# Altium project AccessControl.PrjPcb (part 1 of 2)
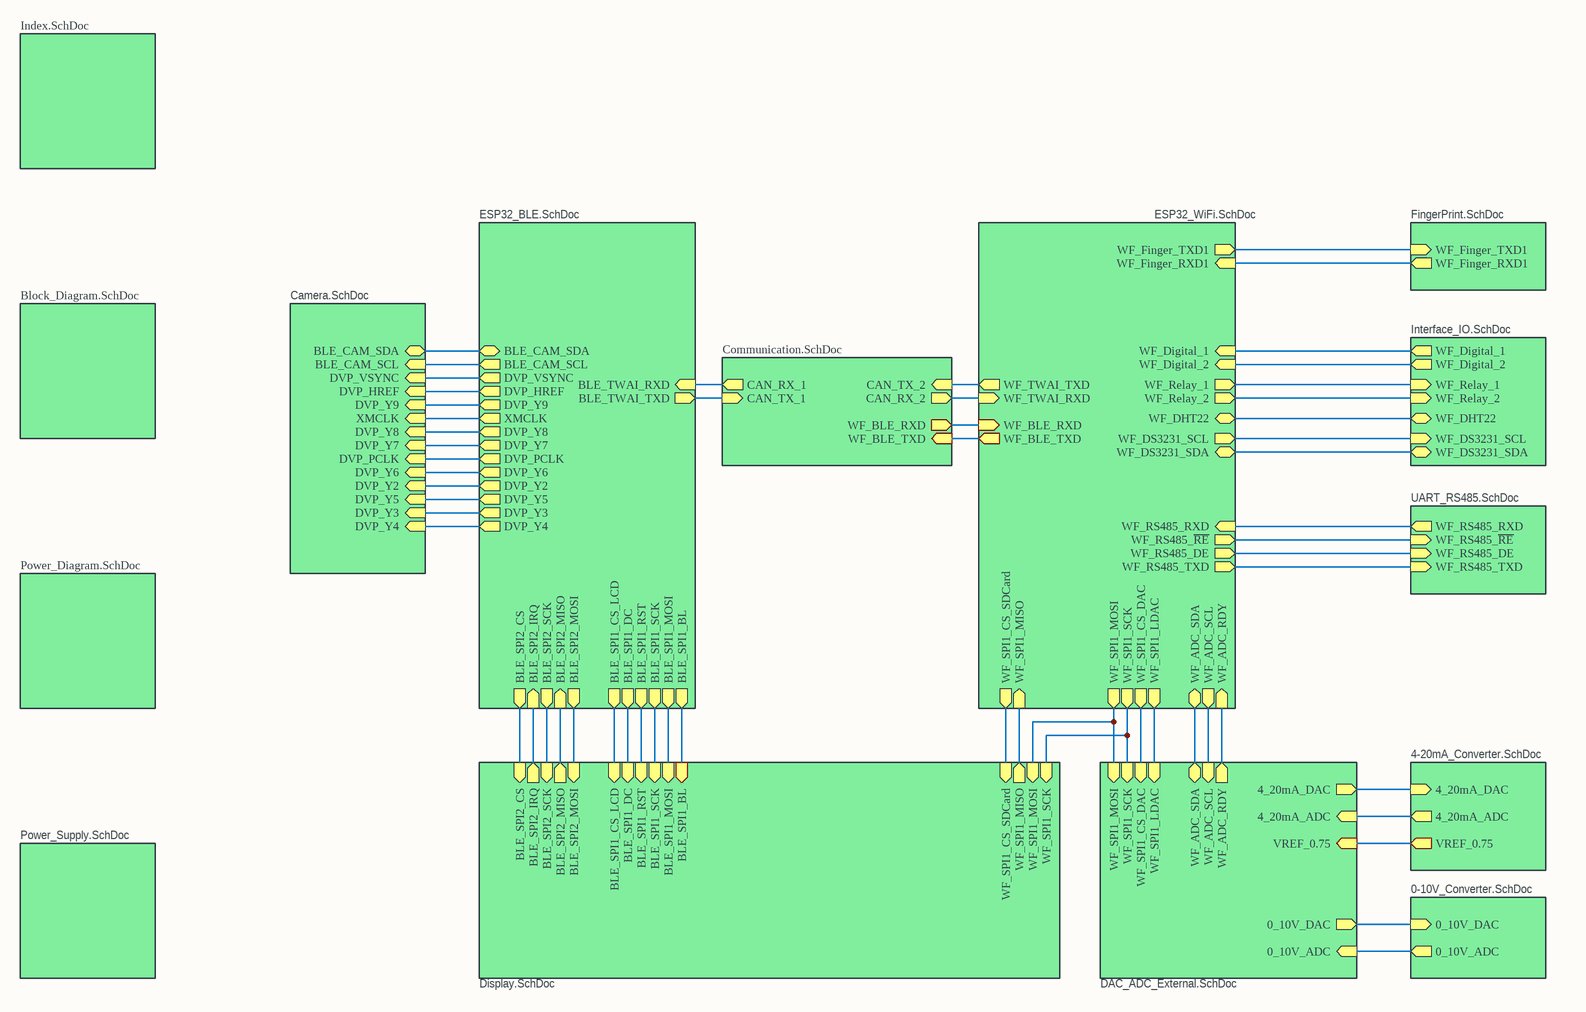
[diagram p0: Overview_Schematic.SchDoc]
16 sheets, 311 parts. Net scope: hierarchical (ports join the sheet entries above them; power ports are global).
Board files: AccessControl_V1.0.0.PcbDoc, AccessControl_V1.0.1.PcbDoc
Sheets:
  Overview_Schematic.SchDoc
    Designator = ESP32_BLE.SchDoc
    Designator = ESP32_WiFi.SchDoc
    Designator = Power_Supply.SchDoc
    Designator = DAC_ADC_External.SchDoc
    Designator = 4-20mA_Converter.SchDoc
    Designator = 0-10V_Converter.SchDoc
    Designator = UART_RS485.SchDoc
    Designator = Camera.SchDoc
    Designator = Display.SchDoc
    Designator = Interface_IO.SchDoc
    Designator = FingerPrint.SchDoc
    Designator = Block_Diagram.SchDoc
    Designator = Index.SchDoc
    Designator = Power_Diagram.SchDoc
    Designator = Communication.SchDoc

## Sheet Overview_Schematic.SchDoc: Access Control
size A3; Project: Bluetooth Gateway; ENG_APP_DATE: --/--/--; DSN_APP_DATE: --/--/--; CHK_APP_DATE: --/--/--; DrawnBy: Q.Thang & T.Khoa; Revision: V1.0.1; SheetNumber: 1; SheetTotal: 16

### Sub-sheets
Designator = ESP32_BLE.SchDoc: BLE_CAM_SDA (bidir), BLE_CAM_SCL (out), DVP_VSYNC (out), DVP_HREF (out), DVP_Y9 (out), XMCLK (out), DVP_Y8 (out), DVP_Y7 (out), DVP_PCLK (out), DVP_Y6 (out), DVP_Y2 (out), DVP_Y5 (out), DVP_Y3 (out), DVP_Y4 (out), BLE_SPI1_DC (out), BLE_SPI1_SCK (out), BLE_SPI1_MOSI (out), BLE_SPI1_RST (out), BLE_SPI1_CS_LCD (out), BLE_SPI2_MOSI (out), BLE_SPI2_MISO (in), BLE_SPI2_SCK (out), BLE_SPI2_IRQ (in), BLE_SPI2_CS (out), BLE_TWAI_RXD (in), BLE_TWAI_TXD (out), BLE_SPI1_BL (out)
Designator = ESP32_WiFi.SchDoc: WF_SPI1_MOSI (out), WF_SPI1_SCK (out), WF_SPI1_CS_DAC (out), WF_SPI1_LDAC (out), WF_RS485_RXD (in), WF_RS485_~{RE} (out), WF_RS485_DE (out), WF_RS485_TXD (out), WF_Digital_1 (in), WF_Digital_2 (in), WF_Relay_1 (out), WF_Relay_2 (out), WF_DHT22 (bidir), WF_DS3231_SCL (out), WF_DS3231_SDA (bidir), WF_Finger_TXD1 (out), WF_Finger_RXD1 (in), WF_TWAI_TXD (out), WF_TWAI_RXD (in), WF_SPI1_MISO (in), WF_SPI1_CS_SDCard (out), WF_ADC_SDA (bidir), WF_ADC_SCL (out), WF_ADC_RDY (in), WF_BLE_RXD (in), WF_BLE_TXD (out)
Designator = Power_Supply.SchDoc: no entries
Designator = DAC_ADC_External.SchDoc: WF_SPI1_MOSI (in), WF_SPI1_SCK (in), WF_SPI1_CS_DAC (in), WF_SPI1_LDAC (in), 4_20mA_DAC (out), 4_20mA_ADC (in), 0_10V_ADC (in), 0_10V_DAC (out), WF_ADC_SDA (bidir), WF_ADC_SCL (in), WF_ADC_RDY (out), VREF_0.75 (in)
Designator = 4-20mA_Converter.SchDoc: 4_20mA_DAC (in), 4_20mA_ADC (out), VREF_0.75 (out)
Designator = 0-10V_Converter.SchDoc: 0_10V_DAC (in), 0_10V_ADC (out)
Designator = UART_RS485.SchDoc: WF_RS485_RXD (out), WF_RS485_~{RE} (in), WF_RS485_DE (in), WF_RS485_TXD (in)
Designator = Camera.SchDoc: BLE_CAM_SDA (bidir), BLE_CAM_SCL (in), DVP_VSYNC (in), DVP_HREF (in), DVP_Y9 (in), XMCLK (in), DVP_Y8 (in), DVP_Y7 (in), DVP_PCLK (in), DVP_Y6 (in), DVP_Y2 (in), DVP_Y5 (in), DVP_Y3 (in), DVP_Y4 (in)
Designator = Display.SchDoc: BLE_SPI1_MOSI (in), BLE_SPI1_SCK (in), BLE_SPI1_CS_LCD (in), BLE_SPI1_DC (in), BLE_SPI1_RST (in), BLE_SPI2_MOSI (in), BLE_SPI2_MISO (out), BLE_SPI2_SCK (in), BLE_SPI2_IRQ (out), BLE_SPI2_CS (in), WF_SPI1_MOSI (in), WF_SPI1_SCK (in), WF_SPI1_CS_SDCard (in), WF_SPI1_MISO (out), BLE_SPI1_BL (in)
Designator = Interface_IO.SchDoc: WF_Digital_1 (out), WF_Digital_2 (out), WF_Relay_1 (in), WF_Relay_2 (in), WF_DHT22 (bidir), WF_DS3231_SCL (in), WF_DS3231_SDA (bidir)
Designator = FingerPrint.SchDoc: WF_Finger_RXD1 (out), WF_Finger_TXD1 (in)
Designator = Block_Diagram.SchDoc: no entries
Designator = Index.SchDoc: no entries
Designator = Power_Diagram.SchDoc: no entries
Designator = Communication.SchDoc: CAN_RX_1 (out), CAN_TX_1 (in), CAN_RX_2 (out), CAN_TX_2 (in), WF_BLE_RXD (out), WF_BLE_TXD (in)

### Nets
Vref_0.75V: sheet Designator/VREF_0.75, sheet Designator/VREF_0.75
NetD11_A: sheet Designator/4_20mA_ADC, sheet Designator/4_20mA_ADC
NetD13_A: sheet Designator/0_10V_ADC, sheet Designator/0_10V_ADC
NetJ3_3: sheet Designator/BLE_CAM_SDA, sheet Designator/BLE_CAM_SDA
NetJ3_5: sheet Designator/BLE_CAM_SCL, sheet Designator/BLE_CAM_SCL
NetJ3_7: sheet Designator/DVP_VSYNC, sheet Designator/DVP_VSYNC
NetJ3_9: sheet Designator/DVP_HREF, sheet Designator/DVP_HREF
NetJ3_12: sheet Designator/DVP_Y9, sheet Designator/DVP_Y9
NetJ3_13: sheet Designator/XMCLK, sheet Designator/XMCLK
NetJ3_14: sheet Designator/DVP_Y8, sheet Designator/DVP_Y8
NetJ3_16: sheet Designator/DVP_Y7, sheet Designator/DVP_Y7
NetJ3_17: sheet Designator/DVP_PCLK, sheet Designator/DVP_PCLK
NetJ3_18: sheet Designator/DVP_Y6, sheet Designator/DVP_Y6
NetJ3_19: sheet Designator/DVP_Y2, sheet Designator/DVP_Y2
NetJ3_20: sheet Designator/DVP_Y5, sheet Designator/DVP_Y5
NetJ3_21: sheet Designator/DVP_Y3, sheet Designator/DVP_Y3
NetJ3_22: sheet Designator/DVP_Y4, sheet Designator/DVP_Y4
NetJ5_2: sheet Designator/WF_DHT22, sheet Designator/WF_DHT22
NetJ7_2: sheet Designator/WF_TWAI_RXD, sheet Designator/WF_BLE_RXD, sheet Designator/CAN_RX_2, sheet Designator/WF_BLE_RXD
NetJ8_2: sheet Designator/WF_TWAI_TXD, sheet Designator/WF_BLE_TXD, sheet Designator/CAN_TX_2, sheet Designator/WF_BLE_TXD
NetLCD1_3: sheet Designator/BLE_SPI1_CS_LCD, sheet Designator/BLE_SPI1_CS_LCD
NetLCD1_4: sheet Designator/BLE_SPI1_RST, sheet Designator/BLE_SPI1_RST
NetLCD1_5: sheet Designator/BLE_SPI1_DC, sheet Designator/BLE_SPI1_DC
NetLCD1_6: sheet Designator/BLE_SPI1_MOSI, sheet Designator/BLE_SPI1_MOSI
NetLCD1_11: sheet Designator/BLE_SPI2_CS, sheet Designator/BLE_SPI2_CS
NetLCD1_12: sheet Designator/BLE_SPI2_MOSI, sheet Designator/BLE_SPI2_MOSI
NetLCD1_13: sheet Designator/BLE_SPI2_MISO, sheet Designator/BLE_SPI2_MISO
NetLCD1_14: sheet Designator/BLE_SPI2_IRQ, sheet Designator/BLE_SPI2_IRQ
NetLCD1_15: sheet Designator/WF_SPI1_CS_SDCard, sheet Designator/WF_SPI1_CS_SDCard
NetLCD1_16: sheet Designator/WF_SPI1_MOSI, sheet Designator/WF_SPI1_MOSI, sheet Designator/WF_SPI1_MOSI
NetLCD1_17: sheet Designator/WF_SPI1_MISO, sheet Designator/WF_SPI1_MISO
NetQ1_1: sheet Designator/BLE_SPI1_BL, sheet Designator/BLE_SPI1_BL
NetR19_2: sheet Designator/BLE_SPI2_SCK, sheet Designator/BLE_SPI2_SCK
NetR35_1: sheet Designator/BLE_SPI1_SCK, sheet Designator/BLE_SPI1_SCK
NetR38_1: sheet Designator/WF_SPI1_SCK, sheet Designator/WF_SPI1_SCK, sheet Designator/WF_SPI1_SCK
NetR43_1: sheet Designator/WF_Finger_RXD1, sheet Designator/WF_Finger_RXD1
NetR44_1: sheet Designator/WF_Finger_TXD1, sheet Designator/WF_Finger_TXD1
NetR46_1: sheet Designator/WF_RS485_RXD, sheet Designator/WF_RS485_RXD
NetR47_1: sheet Designator/WF_RS485_~{RE}, sheet Designator/WF_RS485_~{RE}
NetR49_1: sheet Designator/WF_RS485_DE, sheet Designator/WF_RS485_DE
NetR50_1: sheet Designator/WF_RS485_TXD, sheet Designator/WF_RS485_TXD
NetR56_1: sheet Designator/4_20mA_DAC, sheet Designator/4_20mA_DAC
NetR74_1: sheet Designator/0_10V_DAC, sheet Designator/0_10V_DAC
NetR77_1: sheet Designator/WF_ADC_RDY, sheet Designator/WF_ADC_RDY
NetR78_1: sheet Designator/WF_SPI1_CS_DAC, sheet Designator/WF_SPI1_CS_DAC
NetR79_1: sheet Designator/WF_SPI1_LDAC, sheet Designator/WF_SPI1_LDAC
NetR82_1: sheet Designator/WF_Relay_1, sheet Designator/WF_Relay_1
NetR84_2: sheet Designator/WF_Digital_1, sheet Designator/WF_Digital_1
NetR88_2: sheet Designator/WF_Digital_2, sheet Designator/WF_Digital_2
NetR91_1: sheet Designator/WF_Relay_2, sheet Designator/WF_Relay_2
NetR96_1: sheet Designator/WF_DS3231_SCL, sheet Designator/WF_ADC_SCL, sheet Designator/WF_ADC_SCL, sheet Designator/WF_DS3231_SCL
NetR97_1: sheet Designator/WF_DS3231_SDA, sheet Designator/WF_ADC_SDA, sheet Designator/WF_ADC_SDA, sheet Designator/WF_DS3231_SDA
NetR98_1: sheet Designator/BLE_TWAI_TXD, sheet Designator/CAN_TX_1
NetR102_1: sheet Designator/BLE_TWAI_RXD, sheet Designator/CAN_RX_1

### Notes on the sheet
- Project Name
- Size
- A3
- Revision
- Checked By:
- Drawn By:
- Date:
- File:
- Last Modified:
- Sheet
- of

## Sheet ESP32_BLE.SchDoc: Access Control
size A; DrawnBy: Q.Thang & T.Khoa; Revision: V1.0.1; SheetNumber: 6; SheetTotal: 16
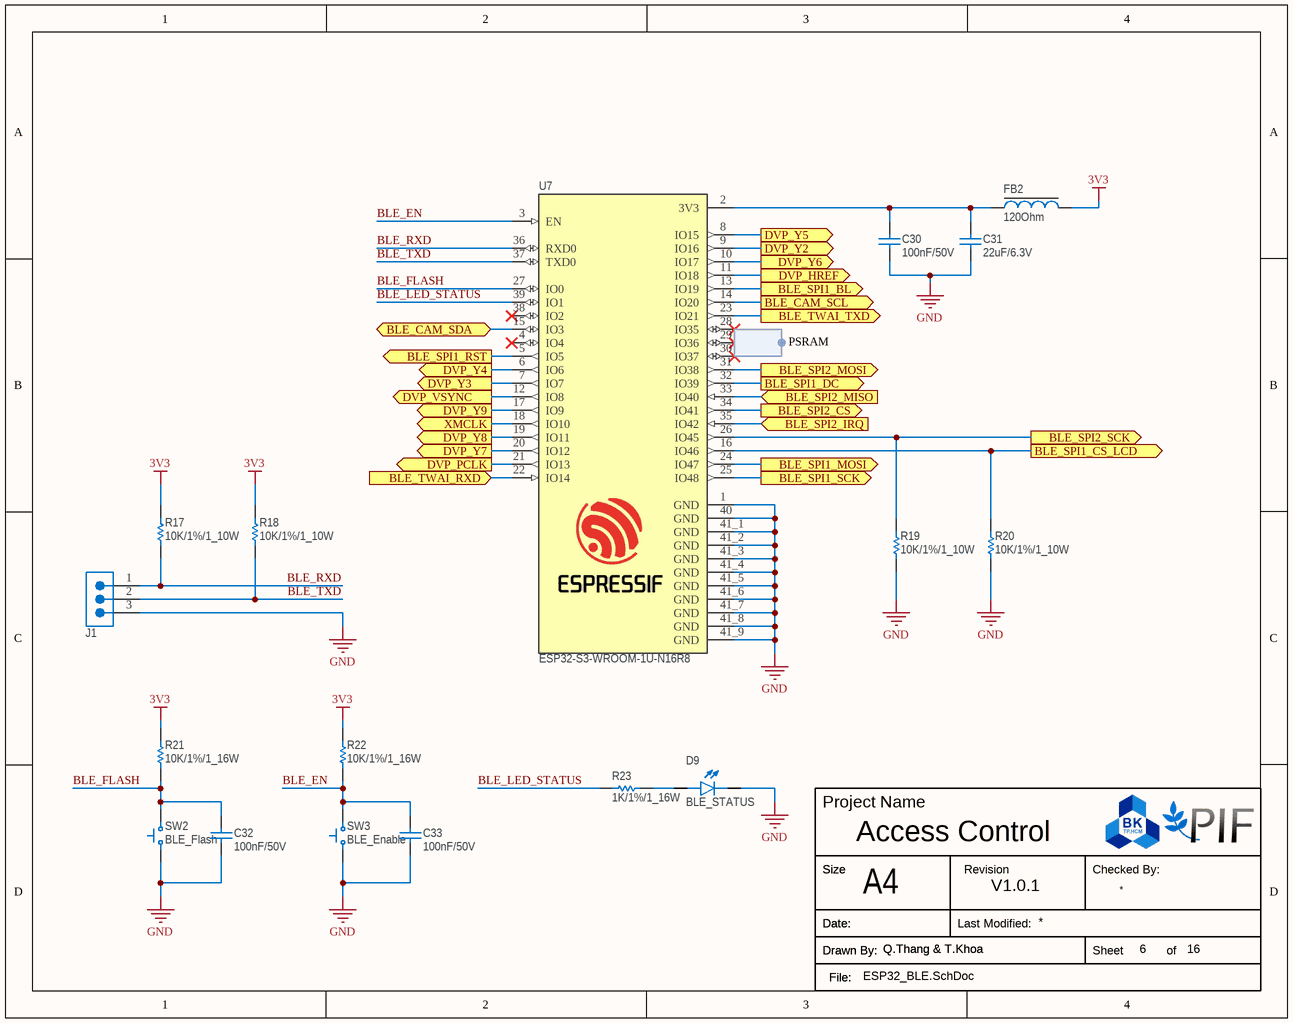
[diagram p1: ESP32_BLE.SchDoc]

### Parts
C30  100nF/50V  [CAP_0805]
C31  22uF/6.3V  [CAP_0805]
C32  100nF/50V  [CAP_0402]
C33  100nF/50V  [CAP_0402]
D9  BLE_STATUS  [LED_0603Y]
FB2  120Ohm  [Ferrite_Bead_0805]
J1  2.54mm_2P  [Header_2.54mm_3P]  (value not drawn)
R17  10K/1%/1_10W  [Resistor_0603]
R18  10K/1%/1_10W  [Resistor_0603]
R19  10K/1%/1_10W  [Resistor_0603]
R20  10K/1%/1_10W  [Resistor_0603]
R21  10K/1%/1_16W  [RESISTOR_0402]
R22  10K/1%/1_16W  [RESISTOR_0402]
R23  1K/1%/1_16W  [RESISTOR_0402]
SW2  BLE_Flash  [Button_3x4mm_SMD_2P]
SW3  BLE_Enable  [Button_3x4mm_SMD_2P]
U7  ESP32-S3-WROOM-1U-N16R8  [XCVR_ESP32-S3-WROOM-1U-N16R8]

### Ports
BLE_CAM_SCL (out, see Overview_Schematic[3B], Camera[2B]), BLE_CAM_SDA (bidir, see Overview_Schematic[3B], Camera[2B]), BLE_SPI1_BL (out, see Overview_Schematic[4C], Display[1D]), BLE_SPI1_CS_LCD (out, see Overview_Schematic[3C], Display[2A]), BLE_SPI1_DC (out, see Overview_Schematic[3C], Display[2A]), BLE_SPI1_MOSI (out, see Overview_Schematic[3C], Display[2A]), BLE_SPI1_RST (out, see Overview_Schematic[3C], Display[2A]), BLE_SPI1_SCK (out, see Overview_Schematic[3C], Display[2B]), BLE_SPI2_CS (out, see Overview_Schematic[3C], Display[2B]), BLE_SPI2_IRQ (in, see Overview_Schematic[3C], Display[2B]), BLE_SPI2_MISO (in, see Overview_Schematic[3C], Display[2B]), BLE_SPI2_MOSI (out, see Overview_Schematic[3C], Display[2B]), BLE_SPI2_SCK (out, see Overview_Schematic[3C], Display[2B]), BLE_TWAI_RXD (in, see Overview_Schematic[4B]), BLE_TWAI_TXD (out, see Overview_Schematic[4B]), DVP_HREF (out, see Overview_Schematic[3B], Camera[3B]), DVP_PCLK (out, see Overview_Schematic[3B], Camera[3B]), DVP_VSYNC (out, see Overview_Schematic[3B], Camera[3B]), DVP_Y2 (out, see Overview_Schematic[3B], Camera[3C]), DVP_Y3 (out, see Overview_Schematic[3B], Camera[3C]), DVP_Y4 (out, see Overview_Schematic[3B], Camera[3C]), DVP_Y5 (out, see Overview_Schematic[3B], Camera[3C]), DVP_Y6 (out, see Overview_Schematic[3B], Camera[3B]), DVP_Y7 (out, see Overview_Schematic[3B], Camera[3B]), DVP_Y8 (out, see Overview_Schematic[3B], Camera[3B]), DVP_Y9 (out, see Overview_Schematic[3B], Camera[3B]), XMCLK (out, see Overview_Schematic[3B], Camera[3B])

### Harnesses
*: 

### Nets
3V3: FB2.2 R17.2 R18.2 R21.2 R22.2
GND: C30.1 C31.1 C32.1 C33.1 D9.C J1.3 R19.1 R20.1 SW2.1 SW3.1 U7.1(GND) U7.40(GND) U7.41_1(GND) U7.41_2(GND) U7.41_3(GND) U7.41_4(GND) U7.41_5(GND) U7.41_6(GND) U7.41_7(GND) U7.41_8(GND) U7.41_9(GND)
BLE_EN: C33.2 R22.1 SW3.2 U7.3(EN)
BLE_FLASH: C32.2 R21.1 SW2.2 U7.27(IO0)
BLE_LED_STATUS: R23.1 U7.39(IO1)
BLE_RXD: J1.1 R17.1 U7.36(RXD0)
BLE_TXD: J1.2 R18.1 U7.37(TXD0)
NetC30_2: C30.2 C31.2 FB2.1 U7.2(3V3)
NetD9_A: D9.A R23.2
NetJ3_3: U7.15(IO3) ; port BLE_CAM_SDA
NetJ3_5: U7.14(IO20) ; port BLE_CAM_SCL
NetJ3_7: U7.12(IO8) ; port DVP_VSYNC
NetJ3_9: U7.11(IO18) ; port DVP_HREF
NetJ3_12: U7.17(IO9) ; port DVP_Y9
NetJ3_13: U7.18(IO10) ; port XMCLK
NetJ3_14: U7.19(IO11) ; port DVP_Y8
NetJ3_16: U7.20(IO12) ; port DVP_Y7
NetJ3_17: U7.21(IO13) ; port DVP_PCLK
NetJ3_18: U7.10(IO17) ; port DVP_Y6
NetJ3_19: U7.9(IO16) ; port DVP_Y2
NetJ3_20: U7.8(IO15) ; port DVP_Y5
NetJ3_21: U7.7(IO7) ; port DVP_Y3
NetJ3_22: U7.6(IO6) ; port DVP_Y4
NetLCD1_3: R20.2 U7.16(IO46) ; port BLE_SPI1_CS_LCD
NetLCD1_4: U7.5(IO5) ; port BLE_SPI1_RST
NetLCD1_5: U7.32(IO39) ; port BLE_SPI1_DC
NetLCD1_6: U7.24(IO47) ; port BLE_SPI1_MOSI
NetLCD1_11: U7.34(IO41) ; port BLE_SPI2_CS
NetLCD1_12: U7.31(IO38) ; port BLE_SPI2_MOSI
NetLCD1_13: U7.33(IO40) ; port BLE_SPI2_MISO
NetLCD1_14: U7.35(IO42) ; port BLE_SPI2_IRQ
NetQ1_1: U7.13(IO19) ; port BLE_SPI1_BL
NetR19_2: R19.2 U7.26(IO45) ; port BLE_SPI2_SCK
NetR35_1: U7.25(IO48) ; port BLE_SPI1_SCK
NetR98_1: U7.23(IO21) ; port BLE_TWAI_TXD
NetR102_1: U7.22(IO14) ; port BLE_TWAI_RXD

Not connected (* = marked no-connect by the designer): U7 4(IO4)* 28(IO35)* 29(IO36)* 30(IO37)* 38(IO2)*

### Notes on the sheet
- PSRAM
- Project Name
- Size
- A4
- Revision
- Checked By:
- Drawn By:
- Date:
- File:
- Last Modified:
- Sheet
- of

### Library data of the parts
C30 = Ceramic_Cap_100nF_50V_0805: CAP, size 0805, 100nF, 50V; Supply Part Number: Tụ Gốm 0805 100nF (0.1uF) 50V; Supply Name: Thegioiic; Datasheet: *; Supply URL: https://www.thegioiic.com/tu-gom-0805-100nf-0-1uf-50v
C31 = Ceramic_Cap_22uF_6.3V_0805: CAP, size 0805, 22uF, 6.3V; Supply Part Number: Tụ Gốm 0805 22uF 6.3V; Supply Name: Thegioiic; Datasheet: *; Supply URL: https://www.thegioiic.com/tu-gom-0805-22uf-6-3v
C32 C33 = Ceramic_Cap_100nF_50V_0402: CAP, size 0402, 100nF, 50V; Supply Part Number: Tụ Gốm 0402 100nF (0.1uF) 50V; Supply Name: Thegioiic; Datasheet: *; Supply URL: https://www.thegioiic.com/tu-gom-0402-100nf-0-1uf-50v
D9 = LED_Yellow_0603: LED Yellow 0603; Supply Part Number: LED Vàng 0603 Dán SMD Trong Suốt Harvatek; Supply Name: Thegioiic; Supply URL: https://www.thegioiic.com/led-vang-0603-dan-smd-trong-suot-harvatek
FB2 = Ferrite_Bead_120Ohm_2A_0805: Ferrite Bead, size 0805, 120Ohm, 2A; Supply Part Number: CBW201209U121T Ferrite Beads 2A 120 Ohm 0805; Supply Name: Thegioiic; Supply URL: https://www.thegioiic.com/cbw201209u121t-ferrite-beads-2a-120-ohm-0805
J1 = Header_2.54mm_3P: Hàng Rào Đực Đơn 2.54mm 40 Chân 1 Hàng Cao 11.2mm Xuyên Lỗ; Supply Name: Thegioiic; Supply Part Number: Hàng Rào Đực Đơn 2.54mm 40 Chân 1 Hàng Cao 11.2mm Xuyên Lỗ; Supply URL: https://www.thegioiic.com/hang-rao-duc-don-2-54mm-40-chan-1-hang-cao-11-2mm-xuyen-lo
R17-R20 = Res_10K_0603_1%: Resistor 0603 10KOhm 1% 1_10W; Supply Part Number: Điện Trở 10 KOhm 0603 1%; Supply Name: Thegioiic; Supply URL: https://www.thegioiic.com/dien-tro-10-kohm-0603-1-
R21 R22 = Res_10K_0402_1%: Resistor 0402 10KOhm 1% 1_16W; Supply Part Number: Điện Trở 10 KOhm 0402 1%; Supply Name: Thegioiic; Supply URL: https://www.thegioiic.com/dien-tro-10-kohm-0402-1-
R23 = Res_1K_0402_1%: Resistor 0402 1KOhm 1% 1_16W; Supply Part Number: Điện Trở 1 KOhm 0402 1%; Supply Name: Thegioiic; Supply URL: https://www.thegioiic.com/dien-tro-1-kohm-0402-1-
SW2 SW3 = Button_SMD_3x4mm_2P: Supply Part Number: Nút Nhấn 3x4mm Cao 2.5mm 2 Chân SMD; Supply Name: Thegioiic; Datasheet: *; Supply URL: https://www.thegioiic.com/nut-nhan-3x4mm-cao-2-5mm-2-chan-smd
U7 = ESP32-S3-WROOM-1U-N16R8: Bluetooth, WiFi 802.11b/g/n, Bluetooth v5.0 Transceiver Module 2.4GHz Antenna Not Included, U.FL Surface Mount; Supply Part Number: ESP32-S3-WROOM-1U-N16R8 Thu Phát Wifi BLE ESP32 16MB; Supply Name: DienTuTuyetNga; Datasheet: https://www.espressif.com/sites/default/files/documentation/esp32-s3_datasheet_en.pdf; Supply URL: https://dientutuyetnga.com/products/esp32-s3-wroom-1u-n16r8-thu-phat-wifi-ble-esp32-16mb

## Sheet ESP32_WiFi.SchDoc: Access Control
size A; DrawnBy: Q.Thang & T.Khoa; Revision: V1.0.1; SheetNumber: 7; SheetTotal: 16
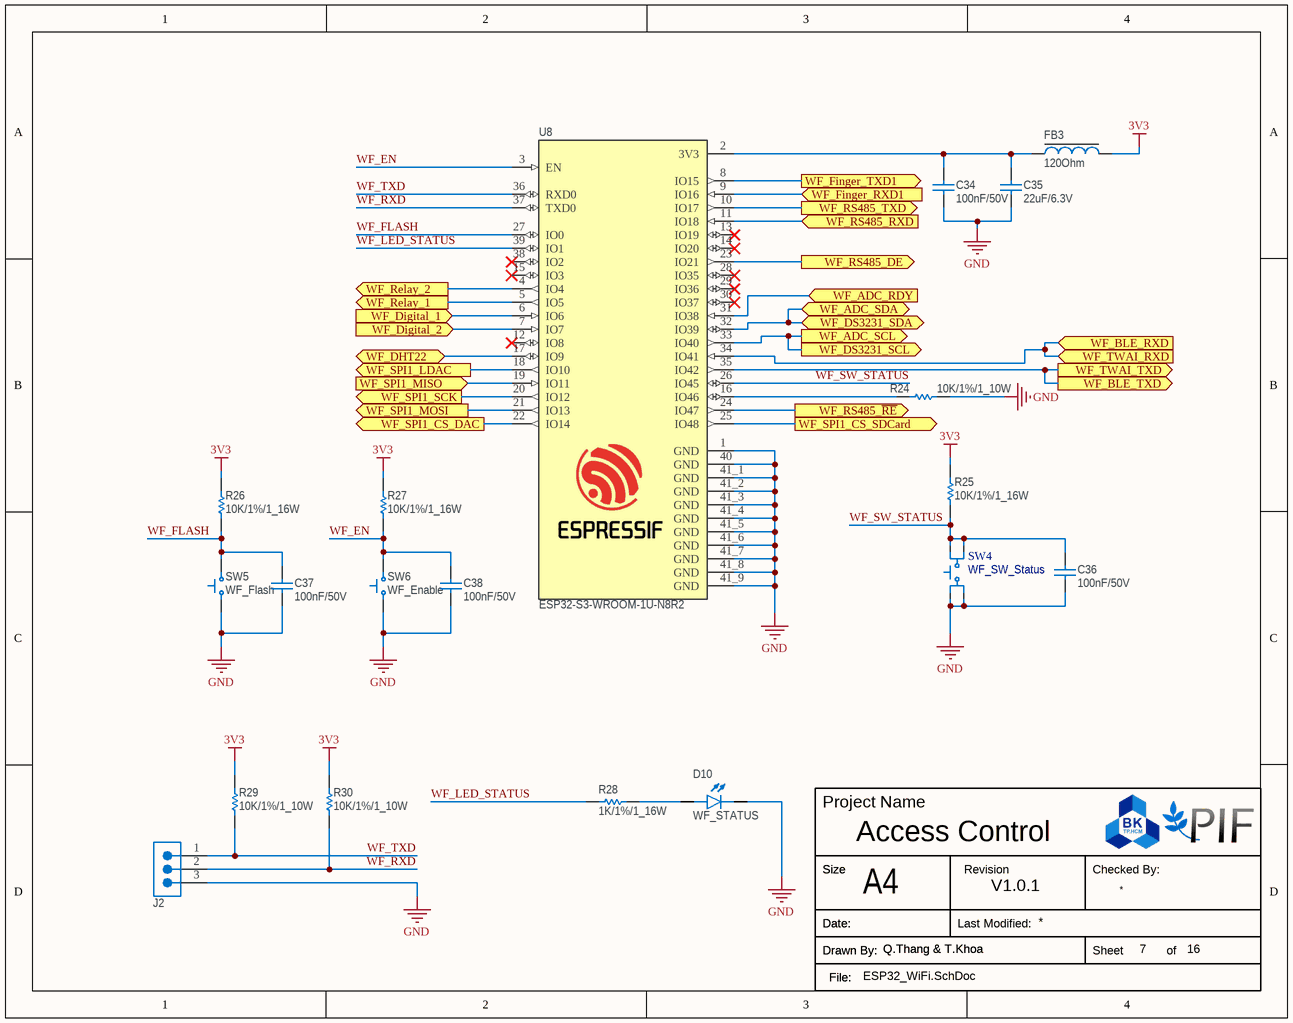
[diagram p2: ESP32_WiFi.SchDoc]

### Parts
C34  100nF/50V  [CAP_0805]
C35  22uF/6.3V  [CAP_0805]
C36  100nF/50V  [CAP_0402]
C37  100nF/50V  [CAP_0402]
C38  100nF/50V  [CAP_0402]
D10  WF_STATUS  [LED_0603Y]
FB3  120Ohm  [Ferrite_Bead_0805]
J2  2.54mm_2P  [Header_2.54mm_3P]  (value not drawn)
R24  10K/1%/1_10W  [Resistor_0603]
R25  10K/1%/1_16W  [RESISTOR_0402]
R26  10K/1%/1_16W  [RESISTOR_0402]
R27  10K/1%/1_16W  [RESISTOR_0402]
R28  1K/1%/1_16W  [RESISTOR_0402]
R29  10K/1%/1_10W  [Resistor_0603]
R30  10K/1%/1_10W  [Resistor_0603]
SW4  WF_SW_Status  [Button_4.5x4.7mm_SMD_4P]
SW5  WF_Flash  [Button_3x4mm_SMD_2P]
SW6  WF_Enable  [Button_3x4mm_SMD_2P]
U8  ESP32-S3-WROOM-1U-N8R2  [XCVR_ESP32-S3-WROOM-1U-N16R8]

### Ports
WF_ADC_RDY (in, see Overview_Schematic[6C], DAC_ADC_External[3A]), WF_ADC_SCL (out, see Overview_Schematic[6C], DAC_ADC_External[2A]), WF_ADC_SDA (bidir, see Overview_Schematic[6C], DAC_ADC_External[2A]), WF_BLE_RXD (in, see Overview_Schematic[5B], Communication[3B]), WF_BLE_TXD (out, see Overview_Schematic[5B], Communication[3B]), WF_DHT22 (bidir, see Overview_Schematic[6B], Interface_IO[4C]), WF_Digital_1 (in, see Overview_Schematic[6B], Interface_IO[7A]), WF_Digital_2 (in, see Overview_Schematic[6B], Interface_IO[7B]), WF_DS3231_SCL (out, see Overview_Schematic[6B], Interface_IO[1C]), WF_DS3231_SDA (bidir, see Overview_Schematic[6B], Interface_IO[1C]), WF_Finger_RXD1 (in, see Overview_Schematic[6B], FingerPrint[1B]), WF_Finger_TXD1 (out, see Overview_Schematic[6A], FingerPrint[1B]), WF_Relay_1 (out, see Overview_Schematic[6B], Interface_IO[1A]), WF_Relay_2 (out, see Overview_Schematic[6B], Interface_IO[1B]), WF_RS485_DE (out, see Overview_Schematic[6B], UART_RS485[1B]), WF_RS485_RXD (in, see Overview_Schematic[6B], UART_RS485[1B]), WF_RS485_TXD (out, see Overview_Schematic[6B], UART_RS485[1B]), WF_RS485_~{RE} (out, see Overview_Schematic[6B], UART_RS485[1B]), WF_SPI1_CS_DAC (out, see Overview_Schematic[5C], DAC_ADC_External[1C]), WF_SPI1_CS_SDCard (out, see Overview_Schematic[5C], Display[2B]), WF_SPI1_LDAC (out, see Overview_Schematic[5C], DAC_ADC_External[1C]), WF_SPI1_MISO (in, see Overview_Schematic[5C], Display[2C]), WF_SPI1_MOSI (out, see Overview_Schematic[5C], DAC_ADC_External[1C], Display[2B]), WF_SPI1_SCK (out, see Overview_Schematic[5C], DAC_ADC_External[1C], Display[2C]), WF_TWAI_RXD (in, see Overview_Schematic[5B]), WF_TWAI_TXD (out, see Overview_Schematic[5B])

### Nets
3V3: FB3.2 R25.2 R26.2 R27.2 R29.2 R30.2
GND: C34.1 C35.1 C36.1 C37.1 C38.1 D10.C J2.3 R24.1 SW4.3 SW4.4 SW5.1 SW6.1 U8.1(GND) U8.40(GND) U8.41_1(GND) U8.41_2(GND) U8.41_3(GND) U8.41_4(GND) U8.41_5(GND) U8.41_6(GND) U8.41_7(GND) U8.41_8(GND) U8.41_9(GND)
WF_EN: C38.2 R27.1 SW6.2 U8.3(EN)
WF_FLASH: C37.2 R26.1 SW5.2 U8.27(IO0)
WF_LED_STATUS: R28.1 U8.39(IO1)
WF_RXD: J2.2 R30.1 U8.37(TXD0)
WF_SW_STATUS: C36.2 R25.1 SW4.1 SW4.2 U8.26(IO45)
WF_TXD: J2.1 R29.1 U8.36(RXD0)
NetC34_2: C34.2 C35.2 FB3.1 U8.2(3V3)
NetD10_A: D10.A R28.2
NetJ5_2: U8.17(IO9) ; port WF_DHT22
NetJ7_2: U8.34(IO41) ; port WF_TWAI_RXD, port WF_BLE_RXD
NetJ8_2: U8.35(IO42) ; port WF_TWAI_TXD, port WF_BLE_TXD
NetLCD1_15: U8.25(IO48) ; port WF_SPI1_CS_SDCard
NetLCD1_16: U8.21(IO13) ; port WF_SPI1_MOSI
NetLCD1_17: U8.19(IO11) ; port WF_SPI1_MISO
NetR24_2: R24.2 U8.16(IO46)
NetR38_1: U8.20(IO12) ; port WF_SPI1_SCK
NetR43_1: U8.9(IO16) ; port WF_Finger_RXD1
NetR44_1: U8.8(IO15) ; port WF_Finger_TXD1
NetR46_1: U8.11(IO18) ; port WF_RS485_RXD
NetR47_1: U8.24(IO47) ; port WF_RS485_~{RE}
NetR49_1: U8.23(IO21) ; port WF_RS485_DE
NetR50_1: U8.10(IO17) ; port WF_RS485_TXD
NetR77_1: U8.31(IO38) ; port WF_ADC_RDY
NetR78_1: U8.22(IO14) ; port WF_SPI1_CS_DAC
NetR79_1: U8.18(IO10) ; port WF_SPI1_LDAC
NetR82_1: U8.5(IO5) ; port WF_Relay_1
NetR84_2: U8.6(IO6) ; port WF_Digital_1
NetR88_2: U8.7(IO7) ; port WF_Digital_2
NetR91_1: U8.4(IO4) ; port WF_Relay_2
NetR96_1: U8.33(IO40) ; port WF_ADC_SCL, port WF_DS3231_SCL
NetR97_1: U8.32(IO39) ; port WF_ADC_SDA, port WF_DS3231_SDA

Not connected (* = marked no-connect by the designer): U8 12(IO8)* 13(IO19)* 14(IO20)* 15(IO3)* 28(IO35)* 29(IO36)* 30(IO37)* 38(IO2)*

### Notes on the sheet
- Project Name
- Size
- A4
- Revision
- Checked By:
- Drawn By:
- Date:
- File:
- Last Modified:
- Sheet
- of

### Library data of the parts
C34 = Ceramic_Cap_100nF_50V_0805: as C30 on sheet ESP32_BLE; Datasheet: *; Supply URL: https://www.thegioiic.com/tu-gom-0805-100nf-0-1uf-50v
C35 = Ceramic_Cap_22uF_6.3V_0805: as C31 on sheet ESP32_BLE; Datasheet: *; Supply URL: https://www.thegioiic.com/tu-gom-0805-22uf-6-3v
C36-C38 = Ceramic_Cap_100nF_50V_0402: as C32 on sheet ESP32_BLE; Datasheet: *; Supply URL: https://www.thegioiic.com/tu-gom-0402-100nf-0-1uf-50v
D10 = LED_Yellow_0603: as D9 on sheet ESP32_BLE; Supply URL: https://www.thegioiic.com/led-vang-0603-dan-smd-trong-suot-harvatek
FB3 = Ferrite_Bead_120Ohm_2A_0805: as FB2 on sheet ESP32_BLE; Supply URL: https://www.thegioiic.com/cbw201209u121t-ferrite-beads-2a-120-ohm-0805
J2 = Header_2.54mm_3P: as J1 on sheet ESP32_BLE; Supply Part Number: Hàng Rào Đực Đơn 2.54mm 40 Chân 1 Hàng Cao 11.2mm Xuyên Lỗ; Supply URL: https://www.thegioiic.com/hang-rao-duc-don-2-54mm-40-chan-1-hang-cao-11-2mm-xuyen-lo
R24 R29 R30 = Res_10K_0603_1%: as R17 on sheet ESP32_BLE; Supply URL: https://www.thegioiic.com/dien-tro-10-kohm-0603-1-
R25-R27 = Res_10K_0402_1%: as R21 on sheet ESP32_BLE; Supply URL: https://www.thegioiic.com/dien-tro-10-kohm-0402-1-
R28 = Res_1K_0402_1%: as R23 on sheet ESP32_BLE; Supply URL: https://www.thegioiic.com/dien-tro-1-kohm-0402-1-
SW4 = Button_SMD_4.5x4.7mm_4P: Supply Part Number: Nút Nhấn Rùa 4.5x4.7mm Cao 1.65mm 4 Chân SMD; Supply Name: Thegioiic; Datasheet: *; Supply URL: https://www.thegioiic.com/nut-nhan-rua-4-5x4-7mm-cao-1-65mm-4-chan-smd
SW5 SW6 = Button_SMD_3x4mm_2P: as SW2 on sheet ESP32_BLE; Datasheet: *; Supply URL: https://www.thegioiic.com/nut-nhan-3x4mm-cao-2-5mm-2-chan-smd
U8 = ESP32-S3-WROOM-1U-N8R2: Bluetooth, WiFi 802.11b/g/n, Bluetooth v5.0 Transceiver Module 2.4GHz Antenna Not Included, U.FL Surface Mount; Supply Part Number: ESP32-S3-WROOM-1U-N8R2 Module WiFi Bluetooth 8MB Flash, 2MB SRAM 2.4GHz; Supply Name: Thegioiic; Datasheet: https://www.espressif.com/sites/default/files/documentation/esp32-s3_datasheet_en.pdf; Supply URL: https://www.thegioiic.com/esp32-s3-wroom-1u-n8r2-module-wifi-bluetooth-8mb-flash-2mb-sram-2-4ghz

## Sheet Power_Supply.SchDoc: Access Control
size A3; DrawnBy: Q.Thang & T.Khoa; Revision: V1.0.1; SheetNumber: 5; SheetTotal: 16
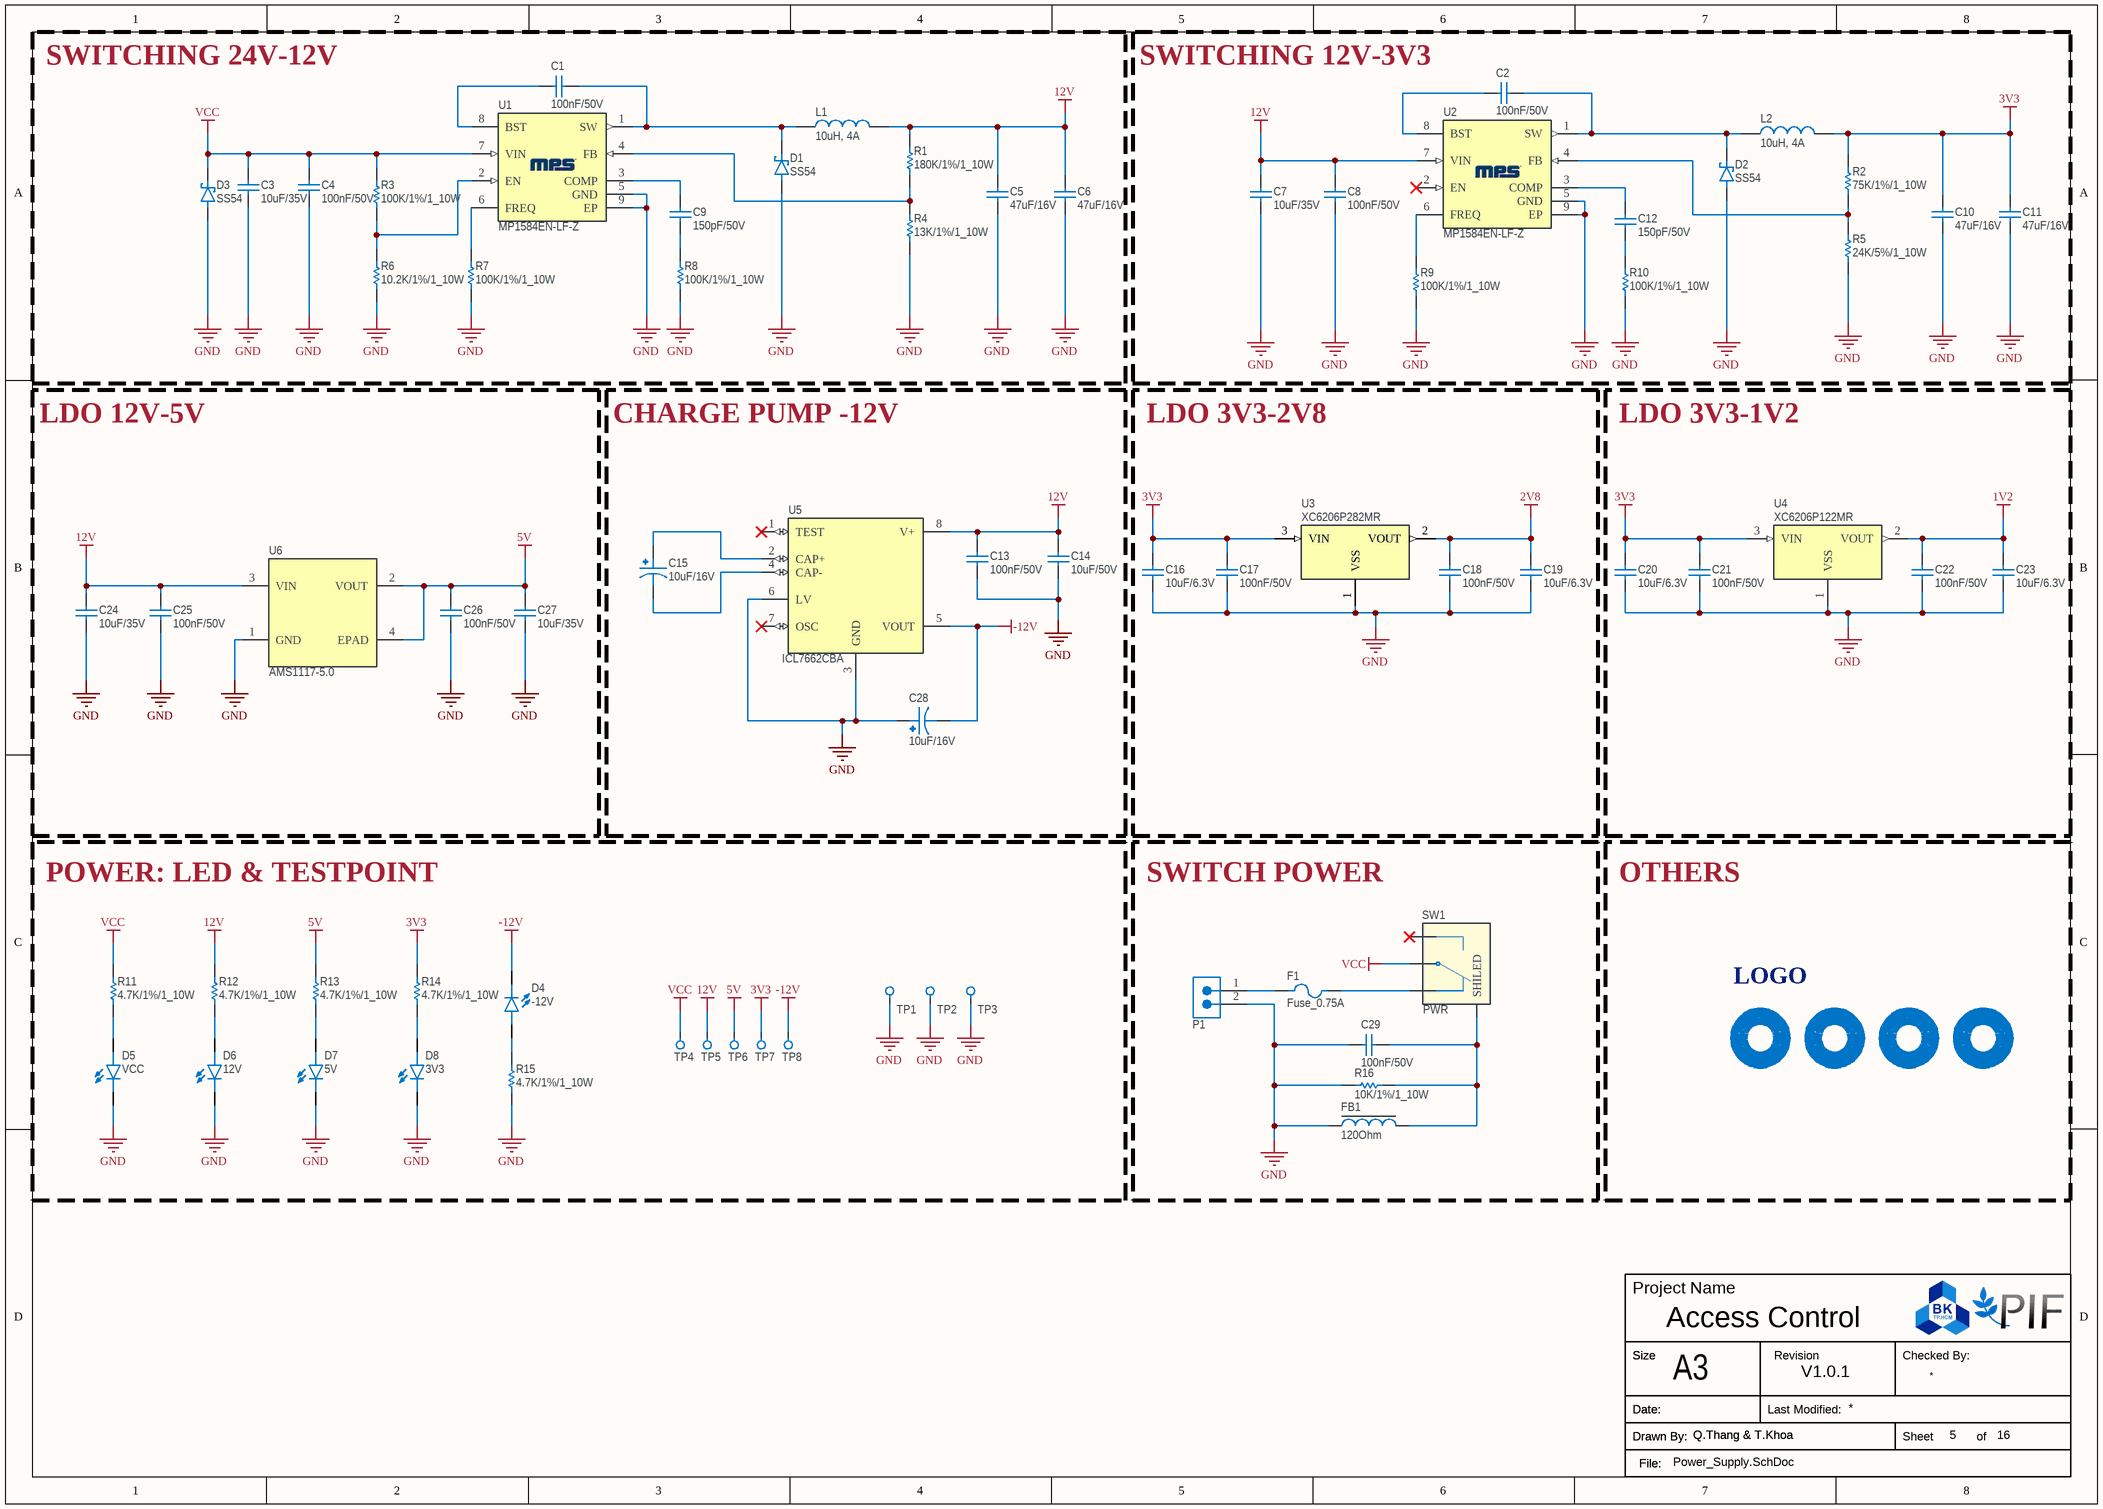
[diagram p3: Power_Supply.SchDoc]

### Parts
*1  LOGO  [BK_LOGO]  (value not drawn)
C1  100nF/50V  [CAP_0603]
C2  100nF/50V  [CAP_0603]
C3  10uF/35V  [CAP_1206]
C4  100nF/50V  [CAP_1206]
C5  47uF/16V  [CAP_1206]
C6  47uF/16V  [CAP_1206]
C7  10uF/35V  [CAP_1206]
C8  100nF/50V  [CAP_1206]
C9  150pF/50V  [CAP_0603]
C10  47uF/16V  [CAP_1206]
C11  47uF/16V  [CAP_1206]
C12  150pF/50V  [CAP_0603]
C13  100nF/50V  [CAP_0805]
C14  10uF/50V  [CAP_0805]
C15  10uF/16V  [TanTa_Cap_A]
C16  10uF/6.3V  [CAP_0603]
C17  100nF/50V  [CAP_0402]
C18  100nF/50V  [CAP_0402]
C19  10uF/6.3V  [CAP_0603]
C20  10uF/6.3V  [CAP_0603]
C21  100nF/50V  [CAP_0402]
C22  100nF/50V  [CAP_0402]
C23  10uF/6.3V  [CAP_0603]
C24  10uF/35V  [CAP_1206]
C25  100nF/50V  [CAP_1206]
C26  100nF/50V  [CAP_1206]
C27  10uF/35V  [CAP_1206]
C28  10uF/16V  [TanTa_Cap_A]
C29  100nF/50V  [CAP_0603]
D1  SS54  [D_SMA]
D2  SS54  [D_SMA]
D3  SS54  [D_SMA]
D4  -12V  [LED_0603Y]
D5  VCC  [LED_0603Y]
D6  12V  [LED_0603Y]
D7  5V  [LED_0603Y]
D8  3V3  [LED_0603Y]
F1  Fuse_0.75A  [FUSER_MF-MSMF075/24-2]
FB1  120Ohm  [Ferrite_Bead_0805]
H1  Mounting Hole without connection  [MountingHole_3.2mm_M3_Pad_Via]  (value not drawn)
H2  Mounting Hole without connection  [MountingHole_3.2mm_M3_Pad_Via]  (value not drawn)
H3  Mounting Hole without connection  [MountingHole_3.2mm_M3_Pad_Via]  (value not drawn)
H4  Mounting Hole without connection  [MountingHole_3.2mm_M3_Pad_Via]  (value not drawn)
L1  10uH, 4A  [Inductor_0630]
L2  10uH, 4A  [Inductor_0630]
P1  5.08mm_2P  [Terminal_Block_5.08mm_2P]  (value not drawn)
R1  180K/1%/1_10W  [Resistor_0603]
R2  75K/1%/1_10W  [Resistor_0603]
R3  100K/1%/1_10W  [Resistor_0603]
R4  13K/1%/1_10W  [Resistor_0603]
R5  24K/5%/1_10W  [Resistor_0603]
R6  10.2K/1%/1_10W  [Resistor_0603]
R7  100K/1%/1_10W  [Resistor_0603]
R8  100K/1%/1_10W  [Resistor_0603]
R9  100K/1%/1_10W  [Resistor_0603]
R10  100K/1%/1_10W  [Resistor_0603]
R11  4.7K/1%/1_10W  [Resistor_0603]
R12  4.7K/1%/1_10W  [Resistor_0603]
R13  4.7K/1%/1_10W  [Resistor_0603]
R14  4.7K/1%/1_10W  [Resistor_0603]
R15  4.7K/1%/1_10W  [Resistor_0603]
R16  10K/1%/1_10W  [Resistor_0603]
SW1  PWR  [MTS-102-C3]
TP1  GND1  [TestPoint_Pad_3.0x3.0mm]  (value not drawn)
TP2  GND2  [TestPoint_Pad_3.0x3.0mm]  (value not drawn)
TP3  GND3  [TestPoint_Pad_3.0x3.0mm]  (value not drawn)
TP4  VCC  [TestPoint_Pad_3.0x3.0mm]  (value not drawn)
TP5  12V  [TestPoint_Pad_3.0x3.0mm]  (value not drawn)
TP6  5V  [TestPoint_Pad_3.0x3.0mm]  (value not drawn)
TP7  3V3  [TestPoint_Pad_3.0x3.0mm]  (value not drawn)
TP8  3V3  [TestPoint_Pad_3.0x3.0mm]  (value not drawn)
U1  MP1584EN-LF-Z  [SOIC-8E]
U2  MP1584EN-LF-Z  [SOIC-8E]
U3  XC6206P282MR  [SOT-23]
U4  XC6206P122MR  [SOT-23]
U5  ICL7662CBA  [SOIC-8]
U6  AMS1117-5.0  [SOT-223]

### Blocks framed on the sheet
SWITCHING 24V-12V: C1 C3-C6 C9 D1 D3 L1 R1 R3 R4 R6-R8 U1
SWITCHING 12V-3V3: C2 C7 C8 C10-C12 D2 L2 R2 R5 R9 R10 U2
LDO 12V-5V: C24-C27 U6
CHARGE PUMP -12V: C13-C15 C28 U5
LDO 3V3-2V8: C16-C19 U3
LDO 3V3-1V2: C20-C23 U4
POWER: LED & TESTPOINT: D4-D8 R11-R15 TP1-TP8
SWITCH POWER: C29 F1 FB1 P1 R16 SW1
OTHERS: *1 H1-H4

### Nets
1V2: C22.2 C23.2 U4.2(VOUT)
2V8: C18.2 C19.2 U3.2(VOUT)
3V3: C10.2 C11.2 C16.2 C17.2 C20.2 C21.2 L2.2 R2.2 R14.2 TP7.1 U3.3(VIN) U4.3(VIN)
5V: C26.2 C27.2 R13.2 TP6.1 U6.2(VOUT) U6.4(EPAD)
12V: C5.2 C6.2 C7.2 C8.2 C13.2 C14.2 C24.2 C25.2 L1.2 R1.2 R12.2 TP5.1 U2.7(VIN) U5.8(V+) U6.3(VIN)
-12V: C28.2 D4.C TP8.1 U5.5(VOUT)
GND: C3.1 C4.1 C5.1 C6.1 C7.1 C8.1 C10.1 C11.1 C13.1 C14.1 C16.1 C17.1 C18.1 C19.1 C20.1 C21.1 C22.1 C23.1 C24.1 C25.1 C26.1 C27.1 C28.1 C29.1 D1.2(A) D2.2(A) D3.2(A) D5.C D6.C D7.C D8.C FB1.2 P1.2 R4.1 R5.1 R6.1 R7.1 R8.1 R9.1 R10.1 R15.2 R16.1 TP1.1 TP2.1 TP3.1 U1.5(GND) U1.9(EP) U2.5(GND) U2.9(EP) U3.1(VSS) U4.1(VSS) U5.3(GND) U5.6(LV) U6.1(GND)
VCC: C3.2 C4.2 D3.1(C) R3.2 R11.2 SW1.2 TP4.1 U1.7(VIN)
NetC1_1: C1.1 U1.8(BST)
NetC1_2: C1.2 D1.1(C) L1.1 U1.1(SW)
NetC2_1: C2.1 U2.8(BST)
NetC2_2: C2.2 D2.1(C) L2.1 U2.1(SW)
NetC9_1: C9.1 R8.2
NetC9_2: C9.2 U1.3(COMP)
NetC12_1: C12.1 R10.2
NetC12_2: C12.2 U2.3(COMP)
NetC15_1: C15.1 U5.2(CAP+)
NetC15_2: C15.2 U5.4(CAP-)
NetC29_2: C29.2 FB1.1 R16.2 SW1.SH(SHILED)
NetD4_A: D4.A R15.1
NetD5_A: D5.A R11.1
NetD6_A: D6.A R12.1
NetD7_A: D7.A R13.1
NetD8_A: D8.A R14.1
NetF1_1: F1.1 P1.1
NetF1_2: F1.2 SW1.1
NetR1_1: R1.1 R4.2 U1.4(FB)
NetR2_1: R2.1 R5.2 U2.4(FB)
NetR3_1: R3.1 R6.2 U1.2(EN)
NetR7_2: R7.2 U1.6(FREQ)
NetR9_2: R9.2 U2.6(FREQ)

Not connected (* = marked no-connect by the designer): SW1 3*; U2 2(EN)*; U5 1(TEST)* 7(OSC)*

### Notes on the sheet
- Project Name
- Size
- A3
- Revision
- Checked By:
- Drawn By:
- Date:
- File:
- Last Modified:
- Sheet
- of

### Library data of the parts
C1 C2 C29 = Ceramic_Cap_100nF_50V_0603: CAP, size 0603, 100nF, 50V; Supply Part Number: Tụ Gốm 0603 100nF (0.1uF) 50V; Supply Name: Thegioiic; Datasheet: *; Supply URL: https://www.thegioiic.com/tu-gom-0603-100nf-0-1uf-50v
C3 C7 C24 C27 = Ceramic_Cap_10uF_35V_1206: CAP, size 1206, 10uF, 35V; Supply Part Number: Tụ Gốm 1206 10uF 35V; Supply Name: Thegioiic; Datasheet: *; Supply URL: https://www.thegioiic.com/tu-gom-1206-10uf-35v
C4 C8 C25 C26 = Ceramic_Cap_100nF_50V_1206: CAP, size 1206, 100nF, 50V; Supply Part Number: Tụ Gốm 1206 100nF (0.1uF) 50V; Supply Name: Thegioiic; Datasheet: *; Supply URL: https://www.thegioiic.com/tu-gom-1206-100nf-0-1uf-50v
C5 C6 C10 C11 = Ceramic_Cap_47uF_16V_1206: CAP, size 1206, 47uF, 16V; Supply Part Number: Tụ Gốm 1206 47uF 16V; Supply Name: Thegioiic; Datasheet: *; Supply URL: https://www.thegioiic.com/tu-gom-1206-47uf-16v
C9 C12 = Ceramic_Cap_150pF_50V_0603: CAP, size 0603, 150pF, 50V; Supply Part Number: Tụ Gốm 0603 150pF 50V; Supply Name: Thegioiic; Datasheet: *; Supply URL: https://www.thegioiic.com/tu-gom-0603-150pf-50v
C13 = Ceramic_Cap_100nF_50V_0805: as C30 on sheet ESP32_BLE; Datasheet: *; Supply URL: https://www.thegioiic.com/tu-gom-0805-100nf-0-1uf-50v
C14 = Ceramic_Cap_10uF_50V_0805: CAP, size 0805, 10uF, 50V; Supply Part Number: Tụ Gốm 0805 10uF 50V; Supply Name: Thegioiic; Datasheet: *; Supply URL: https://www.thegioiic.com/tu-gom-0805-10uf-50v
C15 C28 = Tanta_Cap_10uF_16V_1206: Tantalum Capacitors 10uF 16V 1206; Supply Part Number: AVX; Supply Name: 1206 AVX
C16 C19 C20 C23 = Ceramic_Cap_10uF_6.3V_0603: CAP, size 0603, 10uF, 6.3V; Supply Part Number: CC0603KRX5R5BB106; Supply Name: tme; Datasheet: *; Supply URL: http://www.tme.vn/Product.aspx?id=1165#page=pro_info
C17 C18 C21 C22 = Ceramic_Cap_100nF_50V_0402: as C32 on sheet ESP32_BLE; Datasheet: *; Supply URL: https://www.thegioiic.com/tu-gom-0402-100nf-0-1uf-50v
D1-D3 = Diode_SS54: Diode Schottky 40V 5A Surface Mount SMA; Supply Part Number: SS54 SMA Diode Shotky 5A 40V; Supply Name: Thegioiic; Datasheet: https://www.thegioiic.com/upload/documents/dc8a63b3eda4738bc390d9dc570a4e18.pdf; Supply URL: https://www.thegioiic.com/ss54-sma-diode-shotky-5a-40v
D4-D8 = LED_Yellow_0603: as D9 on sheet ESP32_BLE; Supply URL: https://www.thegioiic.com/led-vang-0603-dan-smd-trong-suot-harvatek
F1 = Fuse_24V_0.75A_1812: MF-MSMF075/24-2 Cầu Chì Tự Phục Hồi 1812 24V 0.75A; Supply Name: Thegioiic; Datasheet: https://www.bourns.com/docs/product-datasheets/mf-msmf.pdf?sfvrsn=4a75e5c0_64; Supply Part Number: MF-MSMF075/24-2 Cầu Chì Tự Phục Hồi 1812 24V 0.75A; Supply URL: https://www.thegioiic.com/mf-msmf075-24-2-cau-chi-tu-phuc-hoi-1812-24v-0-75a
FB1 = Ferrite_Bead_120Ohm_2A_0805: as FB2 on sheet ESP32_BLE; Supply URL: https://www.thegioiic.com/cbw201209u121t-ferrite-beads-2a-120-ohm-0805
H1-H4 = MountingHole: Datasheet: *; Supply Name: *; Supply Part Number: *; Supply URL: *
L1 L2 = IND_10uH_0630: 10uH, 4A, Size 0630; Supply Part Number: Cuộn cảm 10UH 0630; Supply Name: icdayroi; Supply URL: https://icdayroi.com/cuon-cam-10uh-0630
P1 = Terminal_Block_5.08mm_2P: Terminal Block THT, pitch 5.08mm, 2p, 300V, 10A; Supply Part Number: UL-5.08-2-R Terminal Block Plug-in Hàn PCB 2 Chân Cong 5.08mm 300V 15A ULO; Supply Name: Thegioiic; Supply URL: https://www.thegioiic.com/ul-5-08-2-r-terminal-block-plug-in-han-pcb-2-chan-cong-5-08mm-300v-15a-ulo
R1 = Res_180K_0603_1%: Resistor 0603 180KOhm 1% 1_10W; Supply Part Number: Điện Trở 180 KOhm 0603 1%; Supply Name: Thegioiic; Supply URL: https://www.thegioiic.com/dien-tro-180-kohm-0603-1-
R2 = Res_75K_0603_1%: Resistor 0603 75KOhm 1% 1_10W; Supply Part Number: Điện Trở 75 KOhm 0603 1%; Supply Name: Thegioiic; Supply URL: https://www.thegioiic.com/dien-tro-75-kohm-0603-1-
R3 R7-R10 = Res_100K_0603_1%: Resistor 0603 100KOhm 1% 1_10W; Supply Part Number: Điện Trở 100 KOhm 0603 1%; Supply Name: Thegioiic; Supply URL: https://www.thegioiic.com/dien-tro-100-kohm-0603-1-
R4 = Res_13K_0603_1%: Resistor 0603 13KOhm 1% 1_10W; Supply Part Number: Điện Trở 13 KOhm 0603 1%; Supply Name: Thegioiic; Supply URL: https://www.thegioiic.com/dien-tro-13-kohm-0603-1-
R5 = Res_24K_0603_5%: Resistor 0603 24KOhm 5% 1_10W; Supply Part Number: Điện Trở 24 KOhm 0603 5%; Supply Name: Thegioiic; Supply URL: https://www.thegioiic.com/dien-tro-24-kohm-0603-5-
R6 = Res_10.2K_0603_1%: Resistor 0603 10.2KOhm 1% 1_10W; Supply Part Number: Điện Trở 10.2 KOhm 0603 1%; Supply Name: Thegioiic; Supply URL: https://www.thegioiic.com/dien-tro-10-2-kohm-0603-1-
R11-R15 = Res_4.7K_0603_1%: Resistor 0603 4.7KOhm 1% 1_10W; Supply Part Number: Điện Trở 4.7 KOhm 0603 1%; Supply Name: Thegioiic; Supply URL: https://www.thegioiic.com/dien-tro-4-7-kohm-0603-1-
R16 = Res_10K_0603_1%: as R17 on sheet ESP32_BLE; Supply URL: https://www.thegioiic.com/dien-tro-10-kohm-0603-1-
SW1 = MTS-102-C3: Switch Toggle; Supply Part Number: MTS-102-C3 Công Tắc Toggle ON-ON Gạt Giữ 3 Chân Cong 6A 125VAC; Supply Name: Thegioiic; Datasheet: *; Supply URL: https://www.thegioiic.com/mts-102-c3-cong-tac-toggle-on-on-gat-giu-3-chan-cong-6a-125vac
TP1-TP8 = Testpoint_SMD: Datasheet: *; Supply Name: *; Supply Part Number: *; Supply URL: *
U1 U2 = MP1584EN-LF-Z: Buck Switching Regulator IC Positive Adjustable 0.8V 1 Output 3A 8-SOIC _0.154, 3.90mm Width_ Exposed Pad; Supply Name: tme; Datasheet: https://www.monolithicpower.com/en/documentview/productdocument/index/version/2/document_type/Datasheet/lang/en/sku/MP1584EN-LF-Z/document_id/204/?srsltid=AfmBOopCyUDyOs-uLll4YtNPir4o4STehG4B04EkgGGTflYW96m-OPS4; Supply Part Number: MP1584EN-LF-Z; Supply URL: http://www.tme.vn/Product.aspx?id=2070#page=pro_info
U3 = XC6206P282MR: LDO Regulator IC 2.8V; Supply Part Number: IC nguồn XC6206P282MR XC6206-2.8V SOT-23; Supply Name: LinhKienThuDuc; Datasheet: https://product.torexsemi.com/system/files/series/xc6206.pdf; Supply URL: https://linhkienthuduc.com/san-pham/ic-nguon-xc6206p282mr-xc6206-2-8v-sot-23/?srsltid=AfmBOoqd3LZKboXW9OfwVV72Gfw02pCDNwWKEzmEXcFyHjhIUeewssqN
U4 = XC6206P122MR: LDO Regulator IC 1.2V; Supply Part Number: IC nguồn XC6206P122MR XC6206-1.2V SOT-23; Supply Name: LinhKienThuDuc; Datasheet: https://product.torexsemi.com/system/files/series/xc6206.pdf; Supply URL: https://linhkienthuduc.com/san-pham/ic-nguon-xc6206p122mr-xc6206-1-2v-sot-23/?srsltid=AfmBOoqZu0g7j9WGKrjDl4O5a-JCOUfPSMG8bfJmSCZku9rh09-J63is
U5 = ICL7662CBA: Vin: 4.5V ~ 20V, Vout: -Vin, 8-SOIC; Supply Part Number: IC Dán ICL7662; Supply Name: Chipn24; Datasheet: https://www.analog.com/media/en/technical-documentation/data-sheets/icl7662-si7661.pdf; Supply URL: https://chipn24.com/sop-ic-dan-icl7662-sop-8-smd-icl7662cba-id9015.html
U6 = AMS1117-5.0: 5.0V 1A Low dropout (LDO) Voltage Regulator; Supply Name: tme; Datasheet: http://www.advanced-monolithic.com/pdf/ds1117.pdf; Supply Part Number: AMS1117-5.0; Supply URL: http://tme.vn/Product.aspx?id=437#page=pro_info

## Sheet DAC_ADC_External.SchDoc: Access Control
size A; DrawnBy: Q.Thang & T.Khoa; Revision: V1.0.1; SheetNumber: 15; SheetTotal: 16
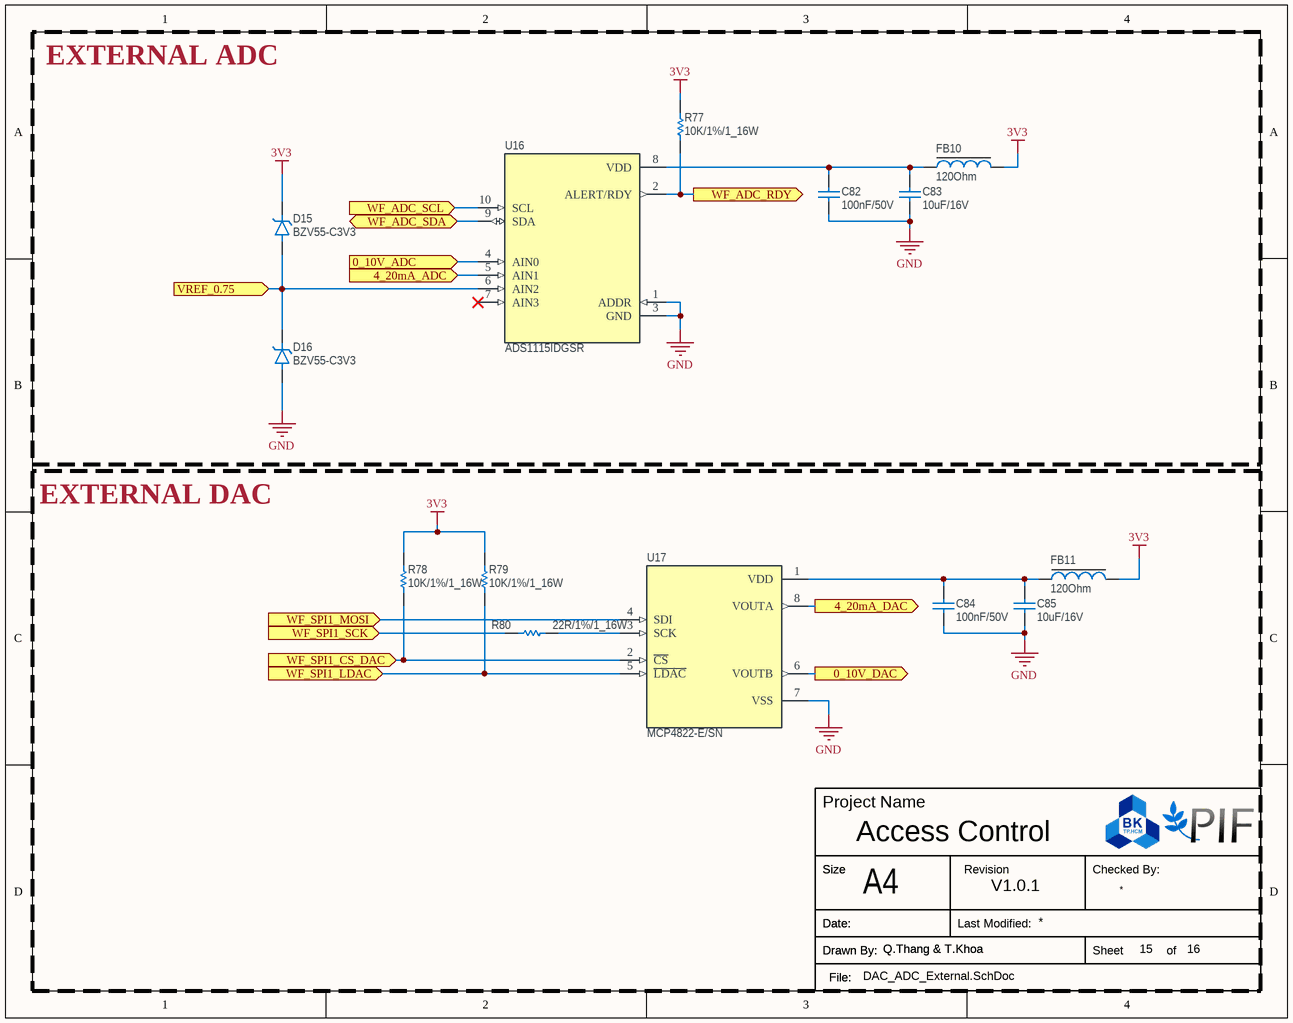
[diagram p4: DAC_ADC_External.SchDoc]

### Parts
C82  100nF/50V  [CAP_0603]
C83  10uF/16V  [CAP_0603]
C84  100nF/50V  [CAP_0603]
C85  10uF/16V  [CAP_0603]
D15  BZV55-C3V3  [SOD-80]
D16  BZV55-C3V3  [SOD-80]
FB10  120Ohm  [Ferrite_Bead_0805]
FB11  120Ohm  [Ferrite_Bead_0805]
R77  10K/1%/1_16W  [RESISTOR_0402]
R78  10K/1%/1_16W  [RESISTOR_0402]
R79  10K/1%/1_16W  [RESISTOR_0402]
R80  22R/1%/1_16W  [RESISTOR_0402]
U16  ADS1115IDGSR  [VSSOP-10]
U17  MCP4822-E/SN  [SOIC-8]

### Blocks framed on the sheet
EXTERNAL ADC: C82 C83 D15 D16 FB10 R77 U16
EXTERNAL DAC: C84 C85 FB11 R78-R80 U17

### Ports
0_10V_ADC (in, see Overview_Schematic[6C], 0-10V_Converter[4A]), 0_10V_DAC (out, see Overview_Schematic[6C], 0-10V_Converter[1C]), 4_20mA_ADC (in, see Overview_Schematic[6C], 4-20mA_Converter[6C]), 4_20mA_DAC (out, see Overview_Schematic[6C], 4-20mA_Converter[1B]), VREF_0.75 (in, see Overview_Schematic[6C], 4-20mA_Converter[6A]), WF_ADC_RDY (out, see Overview_Schematic[6C], ESP32_WiFi[3B]), WF_ADC_SCL (in, see Overview_Schematic[6C], ESP32_WiFi[3B]), WF_ADC_SDA (bidir, see Overview_Schematic[6C], ESP32_WiFi[3B]), WF_SPI1_CS_DAC (in, see Overview_Schematic[5C], ESP32_WiFi[2B]), WF_SPI1_LDAC (in, see Overview_Schematic[5C], ESP32_WiFi[2B]), WF_SPI1_MOSI (in, see Overview_Schematic[5C], Display[2B], ESP32_WiFi[2B]), WF_SPI1_SCK (in, see Overview_Schematic[5C], Display[2C], ESP32_WiFi[2B])

### Nets
3V3: D15.C FB10.2 FB11.2 R77.2 R78.2 R79.2
GND: C82.1 C83.1 C84.1 C85.1 D16.A U16.1(ADDR) U16.3(GND) U17.7(VSS)
Vref_0.75V: D15.A D16.C U16.6(AIN2) ; port VREF_0.75
NetC82_2: C82.2 C83.2 FB10.1 U16.8(VDD)
NetC84_2: C84.2 C85.2 FB11.1 U17.1(VDD)
NetD11_A: U16.5(AIN1) ; port 4_20mA_ADC
NetD13_A: U16.4(AIN0) ; port 0_10V_ADC
NetLCD1_16: U17.4(SDI) ; port WF_SPI1_MOSI
NetR38_1: R80.1 ; port WF_SPI1_SCK
NetR56_1: U17.8(VOUTA) ; port 4_20mA_DAC
NetR74_1: U17.6(VOUTB) ; port 0_10V_DAC
NetR77_1: R77.1 U16.2(ALERT/RDY) ; port WF_ADC_RDY
NetR78_1: R78.1 U17.2(~{CS}) ; port WF_SPI1_CS_DAC
NetR79_1: R79.1 U17.5(~{LDAC}) ; port WF_SPI1_LDAC
NetR80_2: R80.2 U17.3(SCK)
NetR96_1: U16.10(SCL) ; port WF_ADC_SCL
NetR97_1: U16.9(SDA) ; port WF_ADC_SDA

Not connected (* = marked no-connect by the designer): U16 7(AIN3)*

### Notes on the sheet
- Project Name
- Size
- A4
- Revision
- Checked By:
- Drawn By:
- Date:
- File:
- Last Modified:
- Sheet
- of

### Library data of the parts
C82 C84 = Ceramic_Cap_100nF_50V_0603: as C1 on sheet Power_Supply; Datasheet: *; Supply URL: https://www.thegioiic.com/tu-gom-0603-100nf-0-1uf-50v
C83 C85 = Ceramic_Cap_10uF_16V_0603: CAP, size 0603, 10uF, 16V; Supply Part Number: Tụ Gốm 0603 10uF 16V; Supply Name: Thegioiic; Datasheet: *; Supply URL: https://www.thegioiic.com/tu-gom-0603-10uf-16v
D15 D16 = Diode_BZV55C3V3: DIODE ZENER 3.3V 500 mW; Supply Name: tme; Datasheet: https://www.alldatasheet.com/datasheet-pdf/view/17578/PHILIPS/BZV55.html; Supply Part Number: BZV55-C3V3; Supply URL: http://www.tme.vn/Product.aspx?id=1871#page=pro_info
FB10 FB11 = Ferrite_Bead_120Ohm_2A_0805: as FB2 on sheet ESP32_BLE; Supply URL: https://www.thegioiic.com/cbw201209u121t-ferrite-beads-2a-120-ohm-0805
R77-R79 = Res_10K_0402_1%: as R21 on sheet ESP32_BLE; Supply URL: https://www.thegioiic.com/dien-tro-10-kohm-0402-1-
R80 = Res_22R_0402_1%: Resistor 0402 22 Ohm 1% 1_16W; Supply Name: *; Supply Part Number: *; Supply URL: *
U16 = ADS1115IDGSR: Supply Part Number: ADS1115IDGSR IC ADC 16-Bit Sigma-Delta 10-VSSOP; Supply Name: Thegioiic; Datasheet: https://www.ti.com/lit/ds/symlink/ads1114.pdf?ts=1737360738578&ref_url=https%253A%252F%252Fwww.google.com%252F; Supply URL: https://www.thegioiic.com/ads1115idgsr-ic-adc-16-bit-sigma-delta-10-vssop
U17 = MCP4822-E/SN: 12 Bit Digital to Analog Converter 2 8-SOIC; Supply Part Number: MCP4822-E/SN SOIC-8 DAC 12Bit Chính Hãng Microchip; Supply Name: BanLinhKien; Datasheet: https://ww1.microchip.com/downloads/aemDocuments/documents/OTH/ProductDocuments/DataSheets/20002249B.pdf; Supply URL: https://banlinhkien.com/m4822esn-soic8-dac-12bit-chinh-hang-microchip-p6651182.html

## Sheet 4-20mA_Converter.SchDoc: Access Control
size A3; DrawnBy: Q.Thang & T.Khoa; Revision: V1.0.1; SheetNumber: 13; SheetTotal: 16
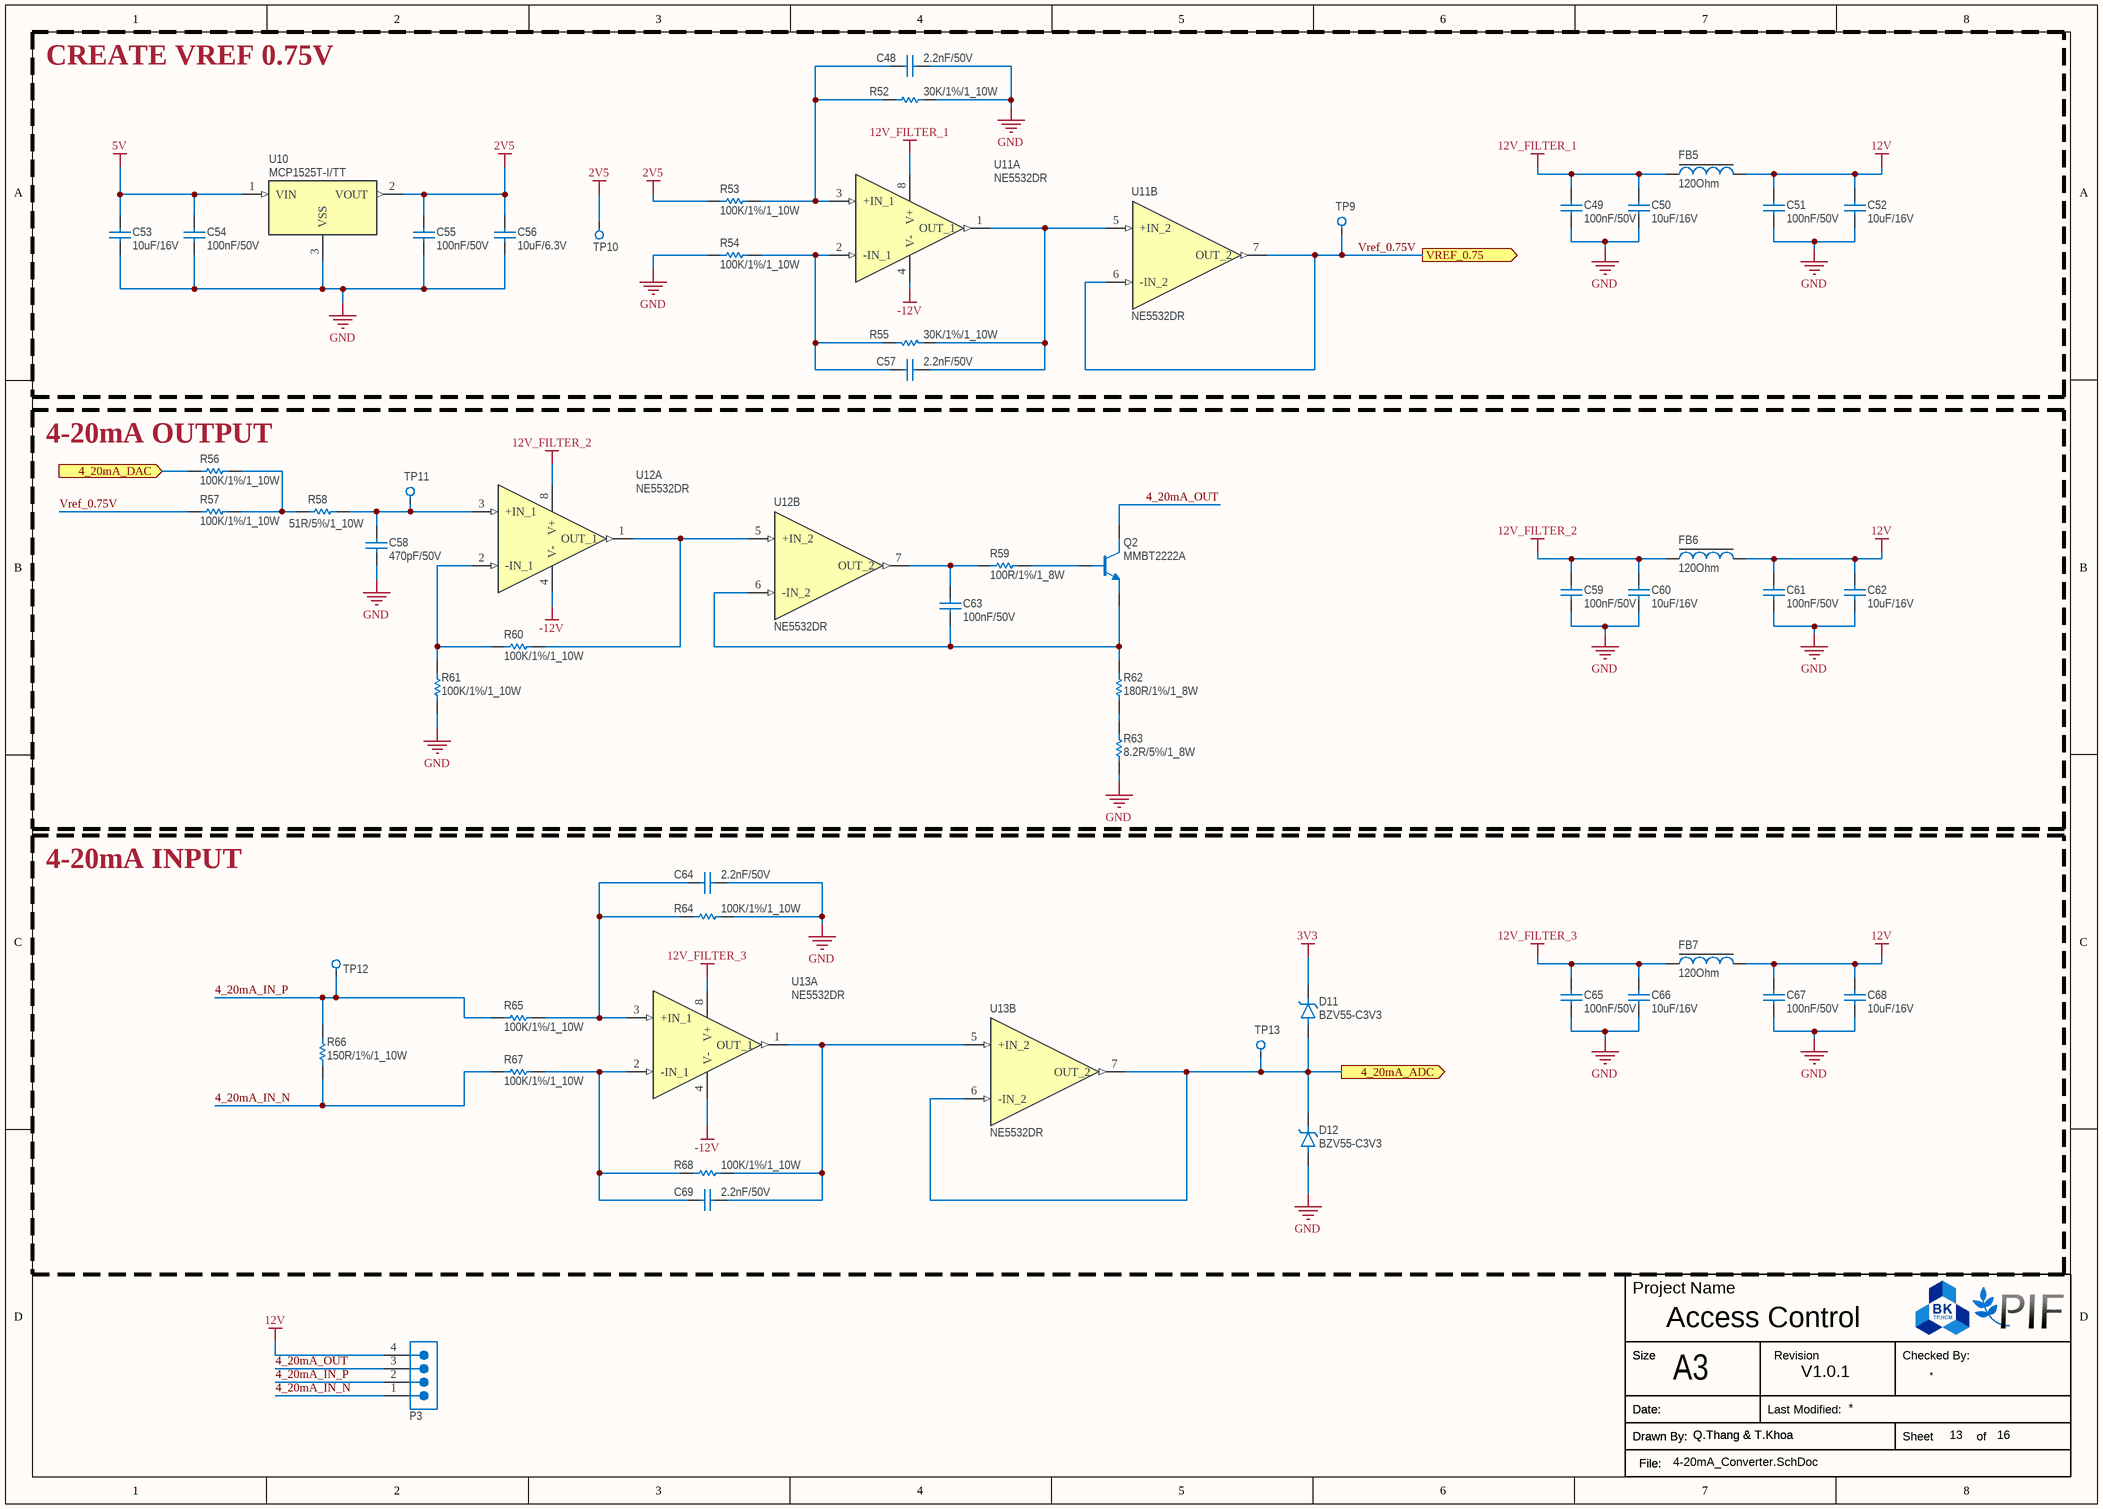
[diagram p5: 4-20mA_Converter.SchDoc]

### Parts
C48  2.2nF/50V  [CAP_0603]
C49  100nF/50V  [CAP_0603]
C50  10uF/16V  [CAP_0603]
C51  100nF/50V  [CAP_0603]
C52  10uF/16V  [CAP_0603]
C53  10uF/16V  [CAP_0603]
C54  100nF/50V  [CAP_0603]
C55  100nF/50V  [CAP_0603]
C56  10uF/6.3V  [CAP_0603]
C57  2.2nF/50V  [CAP_0603]
C58  470pF/50V  [CAP_0603]
C59  100nF/50V  [CAP_0603]
C60  10uF/16V  [CAP_0603]
C61  100nF/50V  [CAP_0603]
C62  10uF/16V  [CAP_0603]
C63  100nF/50V  [CAP_0603]
C64  2.2nF/50V  [CAP_0603]
C65  100nF/50V  [CAP_0603]
C66  10uF/16V  [CAP_0603]
C67  100nF/50V  [CAP_0603]
C68  10uF/16V  [CAP_0603]
C69  2.2nF/50V  [CAP_0603]
D11  BZV55-C3V3  [SOD-80]
D12  BZV55-C3V3  [SOD-80]
FB5  120Ohm  [Ferrite_Bead_0805]
FB6  120Ohm  [Ferrite_Bead_0805]
FB7  120Ohm  [Ferrite_Bead_0805]
P3  3.81mm_4P  [Terminal_Block_3.81mm_4P]  (value not drawn)
Q2  MMBT2222A  [SOT-23]
R52  30K/1%/1_10W  [Resistor_0603]
R53  100K/1%/1_10W  [Resistor_0603]
R54  100K/1%/1_10W  [Resistor_0603]
R55  30K/1%/1_10W  [Resistor_0603]
R56  100K/1%/1_10W  [Resistor_0603]
R57  100K/1%/1_10W  [Resistor_0603]
R58  51R/5%/1_10W  [Resistor_0603]
R59  100R/1%/1_8W  [Resistor_0603]
R60  100K/1%/1_10W  [Resistor_0603]
R61  100K/1%/1_10W  [Resistor_0603]
R62  180R/1%/1_8W  [Resistor_0805]
R63  8.2R/5%/1_8W  [Resistor_0805]
R64  100K/1%/1_10W  [Resistor_0603]
R65  100K/1%/1_10W  [Resistor_0603]
R66  150R/1%/1_10W  [Resistor_0603]
R67  100K/1%/1_10W  [Resistor_0603]
R68  100K/1%/1_10W  [Resistor_0603]
TP9  VREF_0.75V  [TestPoint_Pad_3.0x3.0mm]  (value not drawn)
TP10  2V5  [TestPoint_Pad_3.0x3.0mm]  (value not drawn)
TP11  4-20mA_DAC  [TestPoint_THTPad_D1.5mm_Drill0.7mm]  (value not drawn)
TP12  4_20mA_IN  [TestPoint_THTPad_D1.5mm_Drill0.7mm]  (value not drawn)
TP13  4-20mA_ADC  [TestPoint_THTPad_D1.5mm_Drill0.7mm]  (value not drawn)
U10  MCP1525T-I/TT  [SOT-23]
U11  NE5532DR  [SOIC-8]  (parts A,B of 2)
U12  NE5532DR  [SOIC-8]  (parts A,B of 2)
U13  NE5532DR  [SOIC-8]  (parts A,B of 2)

### Blocks framed on the sheet
CREATE VREF 0.75V: C48-C57 FB5 R52-R55 TP9 TP10 U10 U11
4-20mA OUTPUT: C58-C63 FB6 Q2 R56-R63 TP11 U12
4-20mA INPUT: C64-C69 D11 D12 FB7 R64-R68 TP12 TP13 U13

### Ports
4_20mA_ADC (out, see Overview_Schematic[6C], DAC_ADC_External[2B]), 4_20mA_DAC (in, see Overview_Schematic[6C], DAC_ADC_External[3C]), VREF_0.75 (out, see Overview_Schematic[6C], DAC_ADC_External[1B])

### Nets
2V5: C55.2 C56.2 R53.1 TP10.1 U10.2(VOUT)
3V3: D11.C
5V: C53.2 C54.2 U10.1(VIN)
12V: C51.2 C52.2 C61.2 C62.2 C67.2 C68.2 FB5.2 FB6.2 FB7.2 P3.4
12V_FILTER_1: C49.2 C50.2 FB5.1 U11.8(V+)
12V_FILTER_2: C59.2 C60.2 FB6.1 U12.8(V+)
12V_FILTER_3: C65.2 C66.2 FB7.1 U13.8(V+)
-12V: U11.4(V-) U12.4(V-) U13.4(V-)
GND: C48.2 C49.1 C50.1 C51.1 C52.1 C53.1 C54.1 C55.1 C56.1 C58.1 C59.1 C60.1 C61.1 C62.1 C64.2 C65.1 C66.1 C67.1 C68.1 D12.A R52.2 R54.1 R61.1 R63.2 R64.2 U10.3(VSS)
4_20mA_IN_N: P3.1 R66.1 R67.1
4_20mA_IN_P: P3.2 R65.1 R66.2 TP12.1
4_20mA_OUT: P3.3 Q2.3(C)
Vref_0.75V: R57.1 TP9.1 U11.6(-IN_2) U11.7(OUT_2) ; port VREF_0.75
NetC48_1: C48.1 R52.1 R53.2 U11.3(+IN_1)
NetC57_1: C57.1 R54.2 R55.1 U11.2(-IN_1)
NetC57_2: C57.2 R55.2 U11.1(OUT_1) U11.5(+IN_2)
NetC58_2: C58.2 R58.2 TP11.1 U12.3(+IN_1)
NetC63_1: C63.1 Q2.2(E) R62.2 U12.6(-IN_2)
NetC63_2: C63.2 R59.1 U12.7(OUT_2)
NetC64_1: C64.1 R64.1 R65.2 U13.3(+IN_1)
NetC69_1: C69.1 R67.2 R68.1 U13.2(-IN_1)
NetC69_2: C69.2 R68.2 U13.1(OUT_1) U13.5(+IN_2)
NetD11_A: D11.A D12.C TP13.1 U13.6(-IN_2) U13.7(OUT_2) ; port 4_20mA_ADC
NetQ2_1: Q2.1(B) R59.2
NetR56_1: R56.1 ; port 4_20mA_DAC
NetR56_2: R56.2 R57.2 R58.1
NetR60_1: R60.1 R61.2 U12.2(-IN_1)
NetR60_2: R60.2 U12.1(OUT_1) U12.5(+IN_2)
NetR62_1: R62.1 R63.1

### Notes on the sheet
- Project Name
- Size
- A3
- Revision
- Checked By:
- Drawn By:
- Date:
- File:
- Last Modified:
- Sheet
- of

### Library data of the parts
C48 C57 C64 C69 = Ceramic_Cap_2.2nF_50V_0603: CAP, size 0603, 2.2nF, 50V; Supply Part Number: CC0603KRX7R9BB222; Supply Name: tme; Datasheet: *; Supply URL: http://www.tme.vn/Product.aspx?id=1310#page=pro_info
C49 C51 C54 C55 C59 C61 C63 C65 C67 = Ceramic_Cap_100nF_50V_0603: as C1 on sheet Power_Supply; Datasheet: *; Supply URL: https://www.thegioiic.com/tu-gom-0603-100nf-0-1uf-50v
C50 C52 C53 C60 C62 C66 C68 = Ceramic_Cap_10uF_16V_0603: as C83 on sheet DAC_ADC_External; Datasheet: *; Supply URL: https://www.thegioiic.com/tu-gom-0603-10uf-16v
C56 = Ceramic_Cap_10uF_6.3V_0603: as C16 on sheet Power_Supply; Datasheet: *; Supply URL: http://www.tme.vn/Product.aspx?id=1165#page=pro_info
C58 = Ceramic_Cap_470pF_50V_0603: CAP, size 0603, 470pF, 50V; Supply Part Number: Tụ Gốm 0603 470pF 50V; Supply Name: Thegioiic; Datasheet: *; Supply URL: https://www.thegioiic.com/tu-gom-0603-470pf-50v
D11 D12 = Diode_BZV55C3V3: as D15 on sheet DAC_ADC_External; Datasheet: https://www.alldatasheet.com/datasheet-pdf/view/17578/PHILIPS/BZV55.html; Supply Part Number: BZV55-C3V3; Supply URL: http://www.tme.vn/Product.aspx?id=1871#page=pro_info
FB5-FB7 = Ferrite_Bead_120Ohm_2A_0805: as FB2 on sheet ESP32_BLE; Supply URL: https://www.thegioiic.com/cbw201209u121t-ferrite-beads-2a-120-ohm-0805
P3 = Terminal_Block_3.81mm_4P: Terminal Block THT, pitch 3.81mm, 4p, 300V 10A; Supply Part Number: UL-3.81-4-R Terminal Block Plug-in Hàn PCB 4 Chân Cong 3.81mm 300V 10A ULO; Supply Name: Thegioiic; ComponentLink1Description: Website Link; ComponentLink1URL: https://www.we-online.com/redexpert/article/691322310004?ad; ComponentLink2Description: Datasheet Link; ComponentLink2URL: https://www.we-online.com/redexpert/spec/691322310004?ad; Supply URL: https://www.thegioiic.com/ul-3-81-4-r-terminal-block-plug-in-han-pcb-4-chan-cong-3-81mm-300v-10a-ulo
Q2 = MMBT2222A: Điện áp Vce max: 40V, dòng Ic max: 0.6A, công suất: 0.3W; Supply Part Number: MMBT2222A 1P Transistor NPN 40V 0.6A 3 Chân SOT-23; Supply Name: Thegioiic; Datasheet: https://www.thegioiic.com/upload/documents/1734592311_MMBT2222A.pdf; Supply URL: https://www.thegioiic.com/mmbt2222a-1p-transistor-npn-40v-0-6a-3-chan-sot-23
R52 R55 = Res_30K_0603_1%: Resistor 0603 30KOhm 1% 1_10W; Supply Part Number: Điện Trở 30 KOhm 0603 1%; Supply Name: LinhkienX; Supply URL: https://linhkienx.com/vi/dien-tro-30-kohm-0603-1-
R53 R54 R56 R57 R60 R61 R64 R65 R67 R68 = Res_100K_0603_1%: as R3 on sheet Power_Supply; Supply URL: https://www.thegioiic.com/dien-tro-100-kohm-0603-1-
R58 = Res_51R_0603_5%: Resistor 0603 51 Ohm 5% 1_10W; Supply Part Number: Điện Trở 51 Ohm 0603 5%; Supply Name: Thegioiic; Supply URL: https://www.thegioiic.com/dien-tro-51-ohm-0603-5-
R59 = Res_100R_0805_1%: Resistor 0805 100 Ohm 1% 1_8W; Supply Part Number: Điện Trở 100 Ohm 0805 1%; Supply Name: Thegioiic; Supply URL: https://www.thegioiic.com/dien-tro-100-ohm-0805-1-
R62 = Res_180R_0805_1%: Resistor 0805 180 Ohm 1% 1_8W; Supply Part Number: Điện Trở 180 Ohm 0805 1%; Supply Name: Thegioiic; Supply URL: https://www.thegioiic.com/dien-tro-180-ohm-0805-1-
R63 = Res_8.2R_0805_5%: Resistor 0805 8.2 Ohm 5% 1_8W; Supply Part Number: Điện Trở 8.2 Ohm 0805 5%; Supply Name: Thegioiic; Supply URL: https://www.thegioiic.com/dien-tro-8-2-ohm-0805-5-
R66 = Res_150R_0603_1%: Resistor 0603 150 Ohm 1% 1_10W; Supply Part Number: Điện Trở 150 Ohm 0603 1%; Supply Name: Thegioiic; Supply URL: https://www.thegioiic.com/dien-tro-150-ohm-0603-1-
TP9 TP10 = Testpoint_SMD: Datasheet: *; Supply Name: *; Supply Part Number: *; Supply URL: *
TP11-TP13 = Testpoint_TH: Test Point TEST-1BK; Supply Name: BanLinhKien; Datasheet: *; Supply Part Number: Test Point TEST-1BK; Supply URL: https://banlinhkien.com/test-point-test1bk-mau-den-5c-p18255999.html
U10 = MCP1525T-I/TT: Voltage Reference IC 2.5V; Supply Part Number: MCP1525T-I/TT IC Tham Chiếu Điện Áp 2.5V SOT-23; Supply Name: Thegioiic; Datasheet: https://ww1.microchip.com/downloads/aemDocuments/documents/APID/ProductDocuments/DataSheets/21653C.pdf; Supply URL: https://www.thegioiic.com/mcp1525t-i-tt-ic-tham-chieu-dien-ap-2-5v-sot-23
U11-U13 = NE5532DR: Low Noise Single/Dual Operational Amplifier - SOIC-8; Supply Name: tme; Datasheet: https://www.ti.com/lit/ds/symlink/ne5532.pdf; Supply Part Number: NE5532DR; Supply URL: http://www.tme.vn/Product.aspx?id=2122#page=pro_info

## Sheet 0-10V_Converter.SchDoc: Access Control
size A; DrawnBy: Q.Thang & T.Khoa; Revision: V1.0.1; SheetNumber: 14; SheetTotal: 16
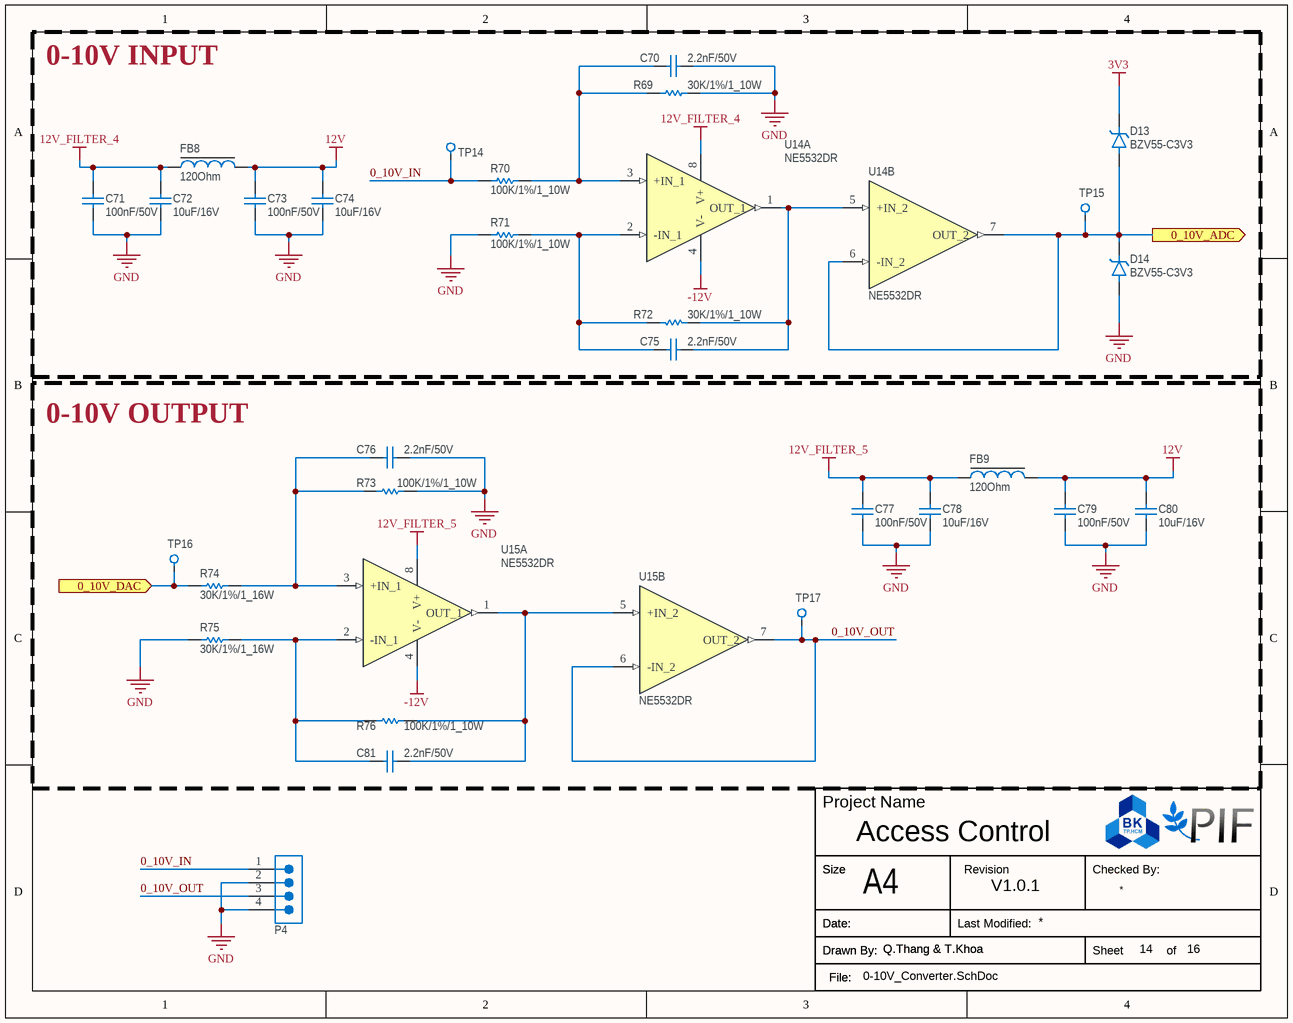
[diagram p6: 0-10V_Converter.SchDoc]

### Parts
C70  2.2nF/50V  [CAP_0603]
C71  100nF/50V  [CAP_0603]
C72  10uF/16V  [CAP_0603]
C73  100nF/50V  [CAP_0603]
C74  10uF/16V  [CAP_0603]
C75  2.2nF/50V  [CAP_0603]
C76  2.2nF/50V  [CAP_0603]
C77  100nF/50V  [CAP_0603]
C78  10uF/16V  [CAP_0603]
C79  100nF/50V  [CAP_0603]
C80  10uF/16V  [CAP_0603]
C81  2.2nF/50V  [CAP_0603]
D13  BZV55-C3V3  [SOD-80]
D14  BZV55-C3V3  [SOD-80]
FB8  120Ohm  [Ferrite_Bead_0805]
FB9  120Ohm  [Ferrite_Bead_0805]
P4  3.81mm_4P  [Terminal_Block_3.81mm_4P]  (value not drawn)
R69  30K/1%/1_10W  [Resistor_0603]
R70  100K/1%/1_10W  [Resistor_0603]
R71  100K/1%/1_10W  [Resistor_0603]
R72  30K/1%/1_10W  [Resistor_0603]
R73  100K/1%/1_10W  [Resistor_0603]
R74  30K/1%/1_16W  [RESISTOR_0402]
R75  30K/1%/1_16W  [RESISTOR_0402]
R76  100K/1%/1_10W  [Resistor_0603]
TP14  0-10V_IN  [TestPoint_THTPad_D1.5mm_Drill0.7mm]  (value not drawn)
TP15  0-10V_ADC  [TestPoint_THTPad_D1.5mm_Drill0.7mm]  (value not drawn)
TP16  0-10V_DAC  [TestPoint_THTPad_D1.5mm_Drill0.7mm]  (value not drawn)
TP17  0-10V_Output  [TestPoint_THTPad_D1.5mm_Drill0.7mm]  (value not drawn)
U14  NE5532DR  [SOIC-8]  (parts A,B of 2)
U15  NE5532DR  [SOIC-8]  (parts A,B of 2)

### Blocks framed on the sheet
0-10V INPUT: C70-C75 D13 D14 FB8 R69-R72 TP14 TP15 U14
0-10V OUTPUT: C76-C81 FB9 R73-R76 TP16 TP17 U15

### Ports
0_10V_ADC (out, see Overview_Schematic[6C], DAC_ADC_External[1B]), 0_10V_DAC (in, see Overview_Schematic[6C], DAC_ADC_External[3C])

### Nets
3V3: D13.C
12V: C73.2 C74.2 C79.2 C80.2 FB8.2 FB9.2
12V_FILTER_4: C71.2 C72.2 FB8.1 U14.8(V+)
12V_FILTER_5: C77.2 C78.2 FB9.1 U15.8(V+)
-12V: U14.4(V-) U15.4(V-)
GND: C70.2 C71.1 C72.1 C73.1 C74.1 C76.2 C77.1 C78.1 C79.1 C80.1 D14.A P4.2 P4.4 R69.2 R71.1 R73.2 R75.1
0_10V_IN: P4.1 R70.1 TP14.1
0_10V_OUT: P4.3 TP17.1 U15.6(-IN_2) U15.7(OUT_2)
NetC70_1: C70.1 R69.1 R70.2 U14.3(+IN_1)
NetC75_1: C75.1 R71.2 R72.1 U14.2(-IN_1)
NetC75_2: C75.2 R72.2 U14.1(OUT_1) U14.5(+IN_2)
NetC76_1: C76.1 R73.1 R74.2 U15.3(+IN_1)
NetC81_1: C81.1 R75.2 R76.1 U15.2(-IN_1)
NetC81_2: C81.2 R76.2 U15.1(OUT_1) U15.5(+IN_2)
NetD13_A: D13.A D14.C TP15.1 U14.6(-IN_2) U14.7(OUT_2) ; port 0_10V_ADC
NetR74_1: R74.1 TP16.1 ; port 0_10V_DAC

### Notes on the sheet
- Project Name
- Size
- A4
- Revision
- Checked By:
- Drawn By:
- Date:
- File:
- Last Modified:
- Sheet
- of

### Library data of the parts
C70 C75 C76 C81 = Ceramic_Cap_2.2nF_50V_0603: as C48 on sheet 4-20mA_Converter; Datasheet: *; Supply URL: http://www.tme.vn/Product.aspx?id=1310#page=pro_info
C71 C73 C77 C79 = Ceramic_Cap_100nF_50V_0603: as C1 on sheet Power_Supply; Datasheet: *; Supply URL: https://www.thegioiic.com/tu-gom-0603-100nf-0-1uf-50v
C72 C74 C78 C80 = Ceramic_Cap_10uF_16V_0603: as C83 on sheet DAC_ADC_External; Datasheet: *; Supply URL: https://www.thegioiic.com/tu-gom-0603-10uf-16v
D13 D14 = Diode_BZV55C3V3: as D15 on sheet DAC_ADC_External; Datasheet: https://www.alldatasheet.com/datasheet-pdf/view/17578/PHILIPS/BZV55.html; Supply Part Number: BZV55-C3V3; Supply URL: http://www.tme.vn/Product.aspx?id=1871#page=pro_info
FB8 FB9 = Ferrite_Bead_120Ohm_2A_0805: as FB2 on sheet ESP32_BLE; Supply URL: https://www.thegioiic.com/cbw201209u121t-ferrite-beads-2a-120-ohm-0805
P4 = Terminal_Block_3.81mm_4P: as P3 on sheet 4-20mA_Converter; ComponentLink1Description: Website Link; ComponentLink1URL: https://www.we-online.com/redexpert/article/691322310004?ad; ComponentLink2Description: Datasheet Link; ComponentLink2URL: https://www.we-online.com/redexpert/spec/691322310004?ad; Supply URL: https://www.thegioiic.com/ul-3-81-4-r-terminal-block-plug-in-han-pcb-4-chan-cong-3-81mm-300v-10a-ulo
R69 R72 = Res_30K_0603_1%: as R52 on sheet 4-20mA_Converter; Supply URL: https://linhkienx.com/vi/dien-tro-30-kohm-0603-1-
R70 R71 R73 R76 = Res_100K_0603_1%: as R3 on sheet Power_Supply; Supply URL: https://www.thegioiic.com/dien-tro-100-kohm-0603-1-
R74 R75 = Res_30K_0402_1%: Resistor 0402 30KOhm 1% 1_16W; Supply Part Number: Điện Trở 30 KOhm 0402 1%; Supply Name: Thegioiic; Supply URL: https://www.thegioiic.com/dien-tro-30-kohm-0402-1-
TP14-TP17 = Testpoint_TH: as TP11 on sheet 4-20mA_Converter; Datasheet: *; Supply Part Number: Test Point TEST-1BK; Supply URL: https://banlinhkien.com/test-point-test1bk-mau-den-5c-p18255999.html
U14 U15 = NE5532DR: as U11 on sheet 4-20mA_Converter; Datasheet: https://www.ti.com/lit/ds/symlink/ne5532.pdf; Supply Part Number: NE5532DR; Supply URL: http://www.tme.vn/Product.aspx?id=2122#page=pro_info